# EAGLE design ViticultureShield (EAGLE 8.6.3)

## Sheet 1 of 10: DUE and Power
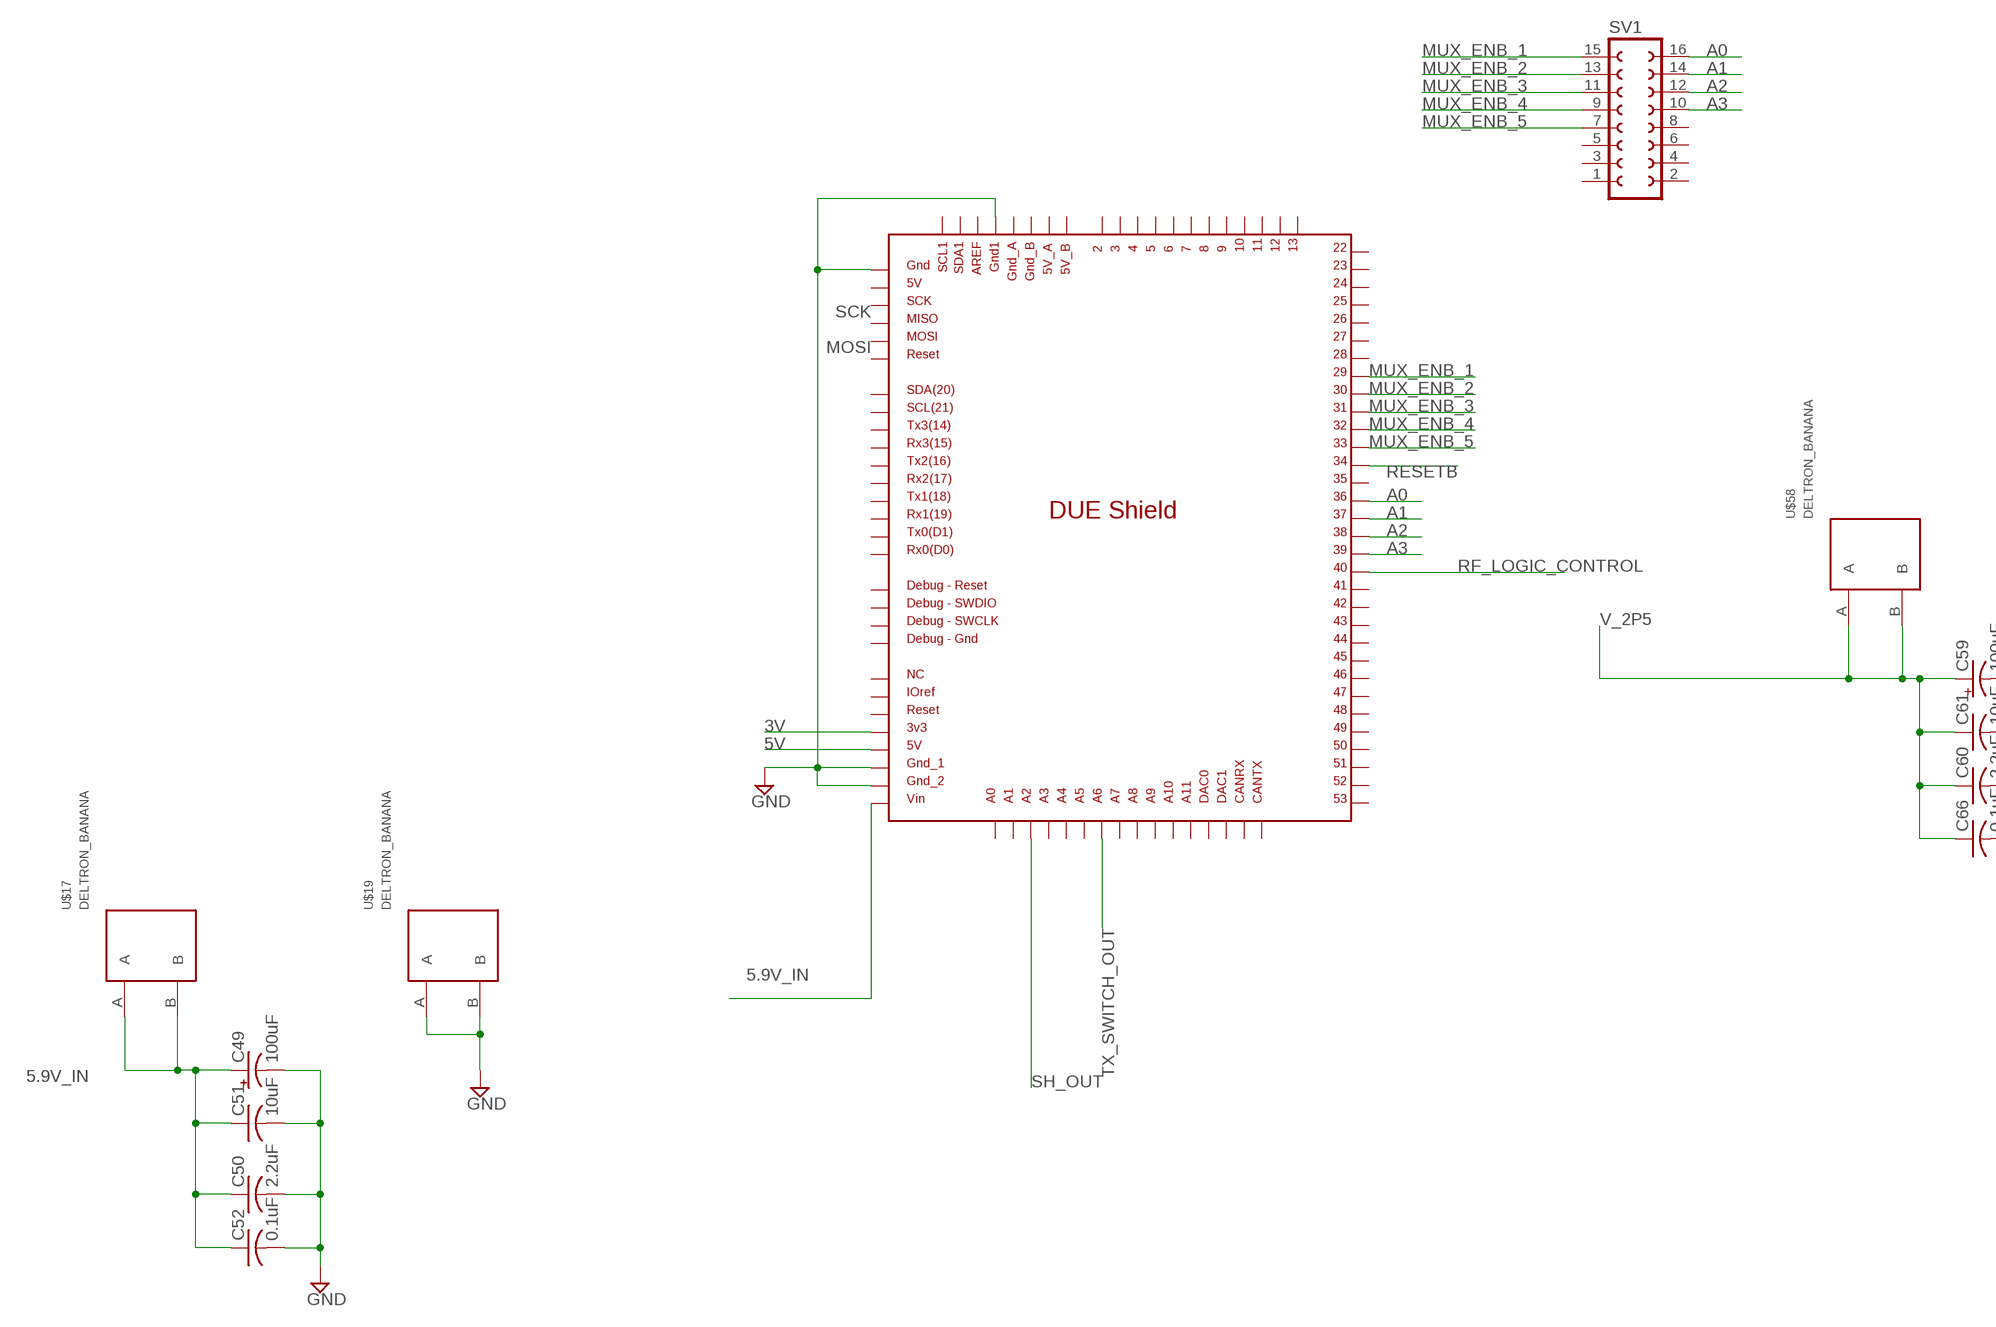
[diagram p0: schematic, sheet 1, part 1 of 2]
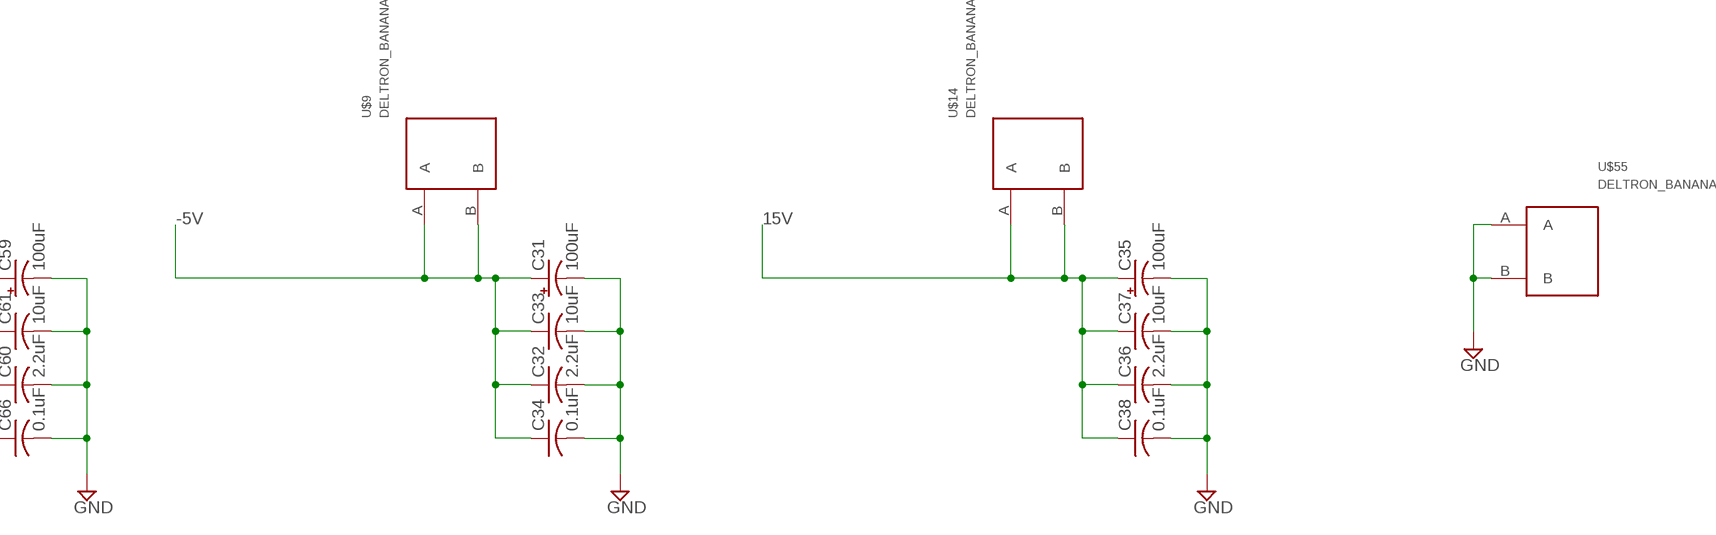
[diagram p1: schematic, sheet 1, part 2 of 2]

### Parts
C31  100uF  CAP_POL_DEV  [CAP_POL_RADIAL_8MM_3P5MMPAD]
C32  2.2uF  C-USC0603  [C0603]
C33  10uF  C-USC1206  [C1206]
C34  0.1uF  C-USC0603  [C0603]
C35  100uF  CAP_POL_DEV  [CAP_POL_RADIAL_8MM_3P5MMPAD]
C36  2.2uF  C-USC0603  [C0603]
C37  10uF  C-USC1206  [C1206]
C38  0.1uF  C-USC0603  [C0603]
C49  100uF  CAP_POL_DEV  [CAP_POL_RADIAL_8MM_3P5MMPAD]
C50  2.2uF  C-USC0603  [C0603]
C51  10uF  C-USC1206  [C1206]
C52  0.1uF  C-USC0603  [C0603]
C59  100uF  CAP_POL_DEV  [CAP_POL_RADIAL_8MM_3P5MMPAD]
C60  2.2uF  C-USC0603  [C0603]
C61  10uF  C-USC1206  [C1206]
C66  0.1uF  C-USC0603  [C0603]
SV1  FE08-2  [FE08-2]
U$1  DUE(NORMAL)  [DUE(NORMAL)]
U$9  DELTRON_BANANA  [DELTRON_BANANA]
U$14  DELTRON_BANANA  [DELTRON_BANANA]
U$17  DELTRON_BANANA  [DELTRON_BANANA]
U$19  DELTRON_BANANA  [DELTRON_BANANA]
U$55  DELTRON_BANANA  [DELTRON_BANANA]
U$58  DELTRON_BANANA  [DELTRON_BANANA]

### Nets
3V: U$1.3V3 ; also sheet 8
5.9V_IN: C49.PIN+ C50.1 C51.1 C52.1 U$1.VIN U$17.A U$17.B
5V: U$1.5V ; also sheet 5,6,8
15V: C35.PIN+ C36.1 C37.1 C38.1 U$14.A U$14.B ; also sheet 6
-5V: C31.PIN+ C32.1 C33.1 C34.1 U$9.A U$9.B ; also sheet 6,7
A0: U$1.36 ; also sheet 2
GND: C31.PIN- C32.2 C33.2 C34.2 C35.PIN- C36.2 C37.2 C38.2 C49.PIN- C50.2 C51.2 C52.2 C59.PIN- C60.2 C61.2 C66.2 U$1.5V_ICSP U$1.GND1 U$1.GND_1 U$1.GND_2 U$19.A U$19.B U$55.A U$55.B ; also sheet 2,3,4,5,6,7,8,9
MUX_ENB_1: SV1.15 U$1.29 ; also sheet 2
MUX_ENB_2: SV1.13 U$1.30 ; also sheet 2
MUX_ENB_3: SV1.11 U$1.31 ; also sheet 2
MUX_ENB_4: SV1.9 U$1.32 ; also sheet 2
MUX_ENB_5: SV1.7 U$1.33 ; also sheet 2
RESETB: U$1.34
RF_LOGIC_CONTROL: U$1.40 ; also sheet 7
SH_OUT: U$1.A2 ; also sheet 6
TX_SWITCH_OUT: U$1.A6
V_2P5: C59.PIN+ C60.1 C61.1 C66.1 U$58.A U$58.B ; also sheet 2
Unconnected: SV1.1 SV1.2 SV1.3 SV1.4 SV1.5 SV1.6 SV1.8 SV1.10 SV1.12 SV1.14 SV1.16 U$1.2 U$1.3 U$1.4 U$1.5 U$1.5V_A U$1.5V_B U$1.6 U$1.7 U$1.8 U$1.9 U$1.10 U$1.11 U$1.12 U$1.13 U$1.22 U$1.23 U$1.24 U$1.25 U$1.26 U$1.27 U$1.28 U$1.35 U$1.37 U$1.38 U$1.39 U$1.41 U$1.42 U$1.43 U$1.44 U$1.45 U$1.46 U$1.47 U$1.48 U$1.49 U$1.50 U$1.51 U$1.52 U$1.53 U$1.A0 U$1.A1 U$1.A3 U$1.A4 U$1.A5 U$1.A7 U$1.A8 U$1.A9 U$1.A10 U$1.A11 U$1.AREF U$1.CANRX U$1.CANTX U$1.DAC0 U$1.DAC1 U$1.GND_A U$1.GND_B U$1.GND_DEBUG U$1.GND_ICSP U$1.IOREF U$1.MISO_ICSP U$1.MOSI_ICSP U$1.NC U$1.RESET U$1.RESET_DEBUG U$1.RESET_ICSP U$1.RX0 U$1.RX1 U$1.RX2 U$1.RX3 U$1.SCK_ICSP U$1.SCL U$1.SCL1 U$1.SDA U$1.SDA1 U$1.SWCLK_DEBUG U$1.SWDIO_DEBUG U$1.TX0 U$1.TX1 U$1.TX2 U$1.TX3

## Sheet 2 of 10: 16:1 Mux's (breakout board)
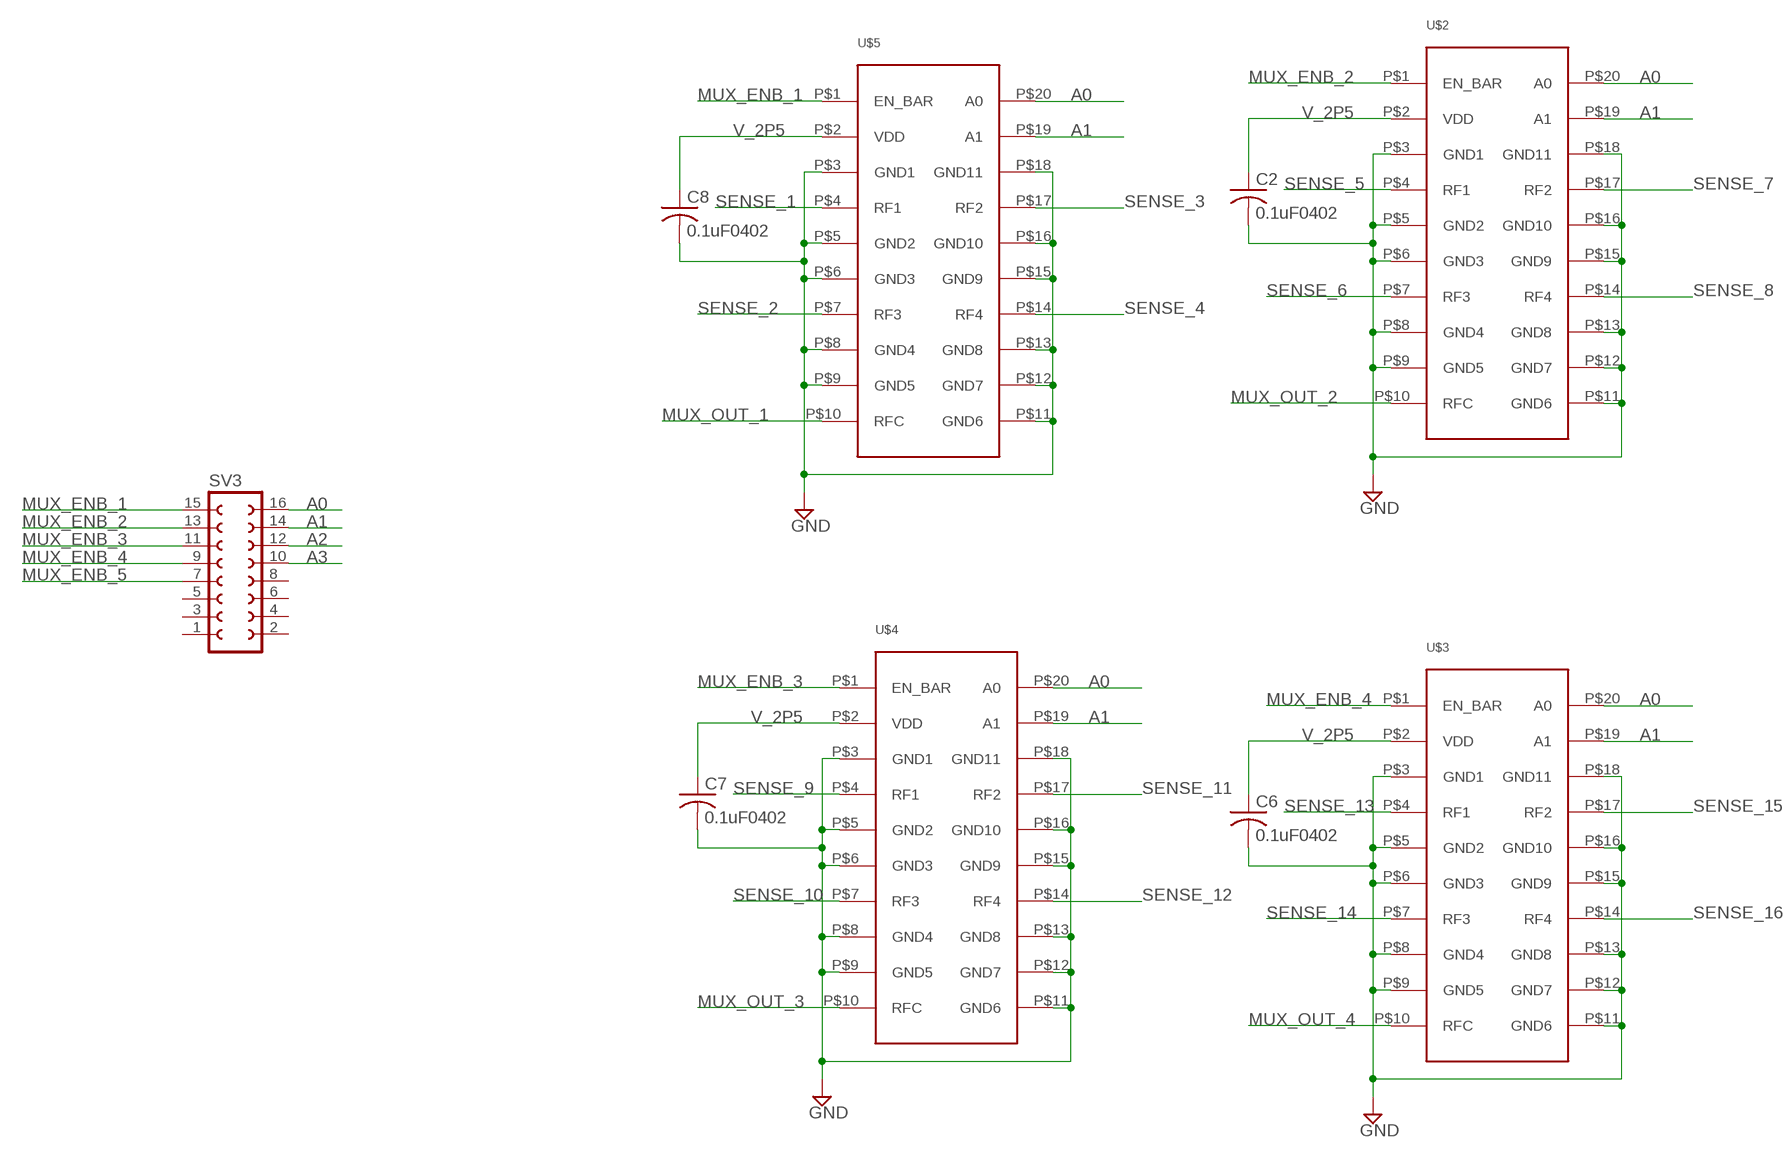
[diagram p2: schematic, sheet 2, part 1 of 2]
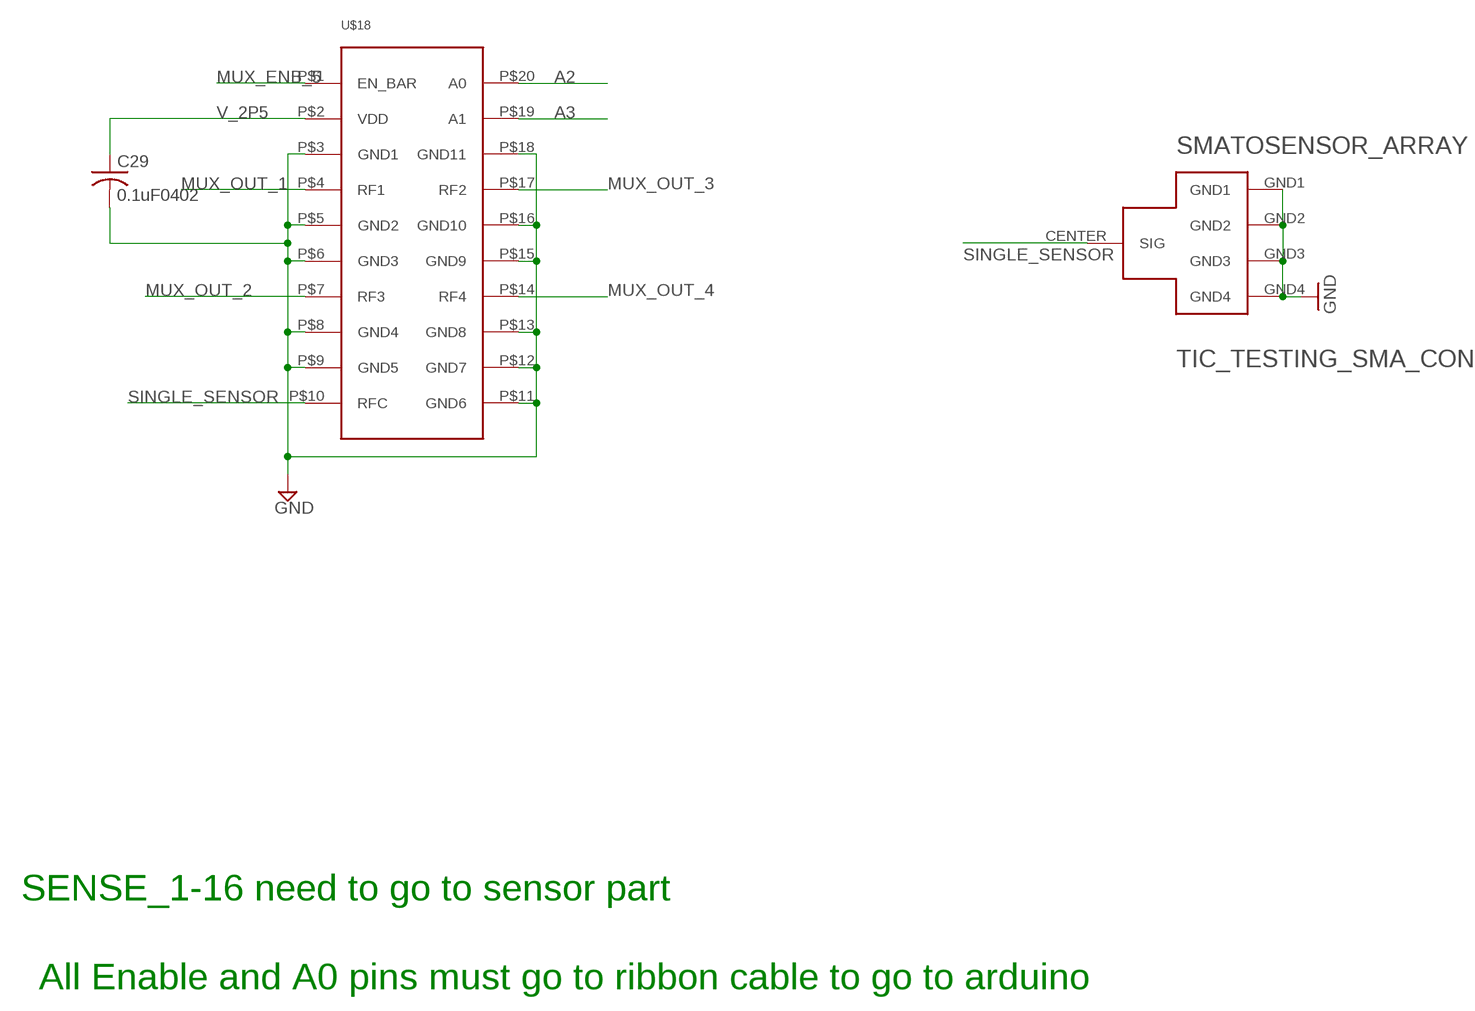
[diagram p3: schematic, sheet 2, part 2 of 2]

### Parts
C2  0.1uF0402  C-USC0402  [C0402]
C6  0.1uF0402  C-USC0402  [C0402]
C7  0.1uF0402  C-USC0402  [C0402]
C8  0.1uF0402  C-USC0402  [C0402]
C29  0.1uF0402  C-USC0402  [C0402]
SMATOSENSOR_ARRAY  TIC_TESTING_SMA_CONN  [TIC_TESTING_SMA_CONNECTOR_V1]
SV3  FE08-2  [FE08-2]
U$2  TICLIB2_ADG904  [TICLIB2_ADG904_TSSOP]
U$3  TICLIB2_ADG904  [TICLIB2_ADG904_TSSOP]
U$4  TICLIB2_ADG904  [TICLIB2_ADG904_TSSOP]
U$5  TICLIB2_ADG904  [TICLIB2_ADG904_TSSOP]
U$18  TICLIB2_ADG904  [TICLIB2_ADG904_TSSOP]

### Nets
A0: SV3.16 U$2.P$20(A0) U$3.P$20(A0) U$4.P$20(A0) U$5.P$20(A0) ; also sheet 1
A1: SV3.14 U$2.P$19(A1) U$3.P$19(A1) U$4.P$19(A1) U$5.P$19(A1) ; also sheet 1
A2: SV3.12 U$18.P$20(A0) ; also sheet 1
A3: SV3.10 U$18.P$19(A1) ; also sheet 1
GND: C2.2 C6.2 C7.2 C8.2 C29.2 SMATOSENSOR_ARRAY.GND1 SMATOSENSOR_ARRAY.GND2 SMATOSENSOR_ARRAY.GND3 SMATOSENSOR_ARRAY.GND4 U$2.P$3(GND1) U$2.P$5(GND2) U$2.P$6(GND3) U$2.P$8(GND4) U$2.P$9(GND5) U$2.P$11(GND6) U$2.P$12(GND7) U$2.P$13(GND8) U$2.P$15(GND9) U$2.P$16(GND10) U$2.P$18(GND11) U$3.P$3(GND1) U$3.P$5(GND2) U$3.P$6(GND3) U$3.P$8(GND4) U$3.P$9(GND5) U$3.P$11(GND6) U$3.P$12(GND7) U$3.P$13(GND8) U$3.P$15(GND9) U$3.P$16(GND10) U$3.P$18(GND11) U$4.P$3(GND1) U$4.P$5(GND2) U$4.P$6(GND3) U$4.P$8(GND4) U$4.P$9(GND5) U$4.P$11(GND6) U$4.P$12(GND7) U$4.P$13(GND8) U$4.P$15(GND9) U$4.P$16(GND10) U$4.P$18(GND11) U$5.P$3(GND1) U$5.P$5(GND2) U$5.P$6(GND3) U$5.P$8(GND4) U$5.P$9(GND5) U$5.P$11(GND6) U$5.P$12(GND7) U$5.P$13(GND8) U$5.P$15(GND9) U$5.P$16(GND10) U$5.P$18(GND11) U$18.P$3(GND1) U$18.P$5(GND2) U$18.P$6(GND3) U$18.P$8(GND4) U$18.P$9(GND5) U$18.P$11(GND6) U$18.P$12(GND7) U$18.P$13(GND8) U$18.P$15(GND9) U$18.P$16(GND10) U$18.P$18(GND11) ; also sheet 1,3,4,5,6,7,8,9
MUX_ENB_1: SV3.15 U$5.P$1(EN_BAR) ; also sheet 1
MUX_ENB_2: SV3.13 U$2.P$1(EN_BAR) ; also sheet 1
MUX_ENB_3: SV3.11 U$4.P$1(EN_BAR) ; also sheet 1
MUX_ENB_4: SV3.9 U$3.P$1(EN_BAR) ; also sheet 1
MUX_ENB_5: SV3.7 U$18.P$1(EN_BAR) ; also sheet 1
MUX_OUT_1: U$5.P$10(RFC) U$18.P$4(RF1)
MUX_OUT_2: U$2.P$10(RFC) U$18.P$7(RF3)
MUX_OUT_3: U$4.P$10(RFC) U$18.P$17(RF2)
MUX_OUT_4: U$3.P$10(RFC) U$18.P$14(RF4)
SENSE_1: U$5.P$4(RF1)
SENSE_2: U$5.P$7(RF3)
SENSE_3: U$5.P$17(RF2)
SENSE_4: U$5.P$14(RF4)
SENSE_5: U$2.P$4(RF1)
SENSE_6: U$2.P$7(RF3)
SENSE_7: U$2.P$17(RF2)
SENSE_8: U$2.P$14(RF4)
SENSE_9: U$4.P$4(RF1)
SENSE_10: U$4.P$7(RF3)
SENSE_11: U$4.P$17(RF2)
SENSE_12: U$4.P$14(RF4)
SENSE_13: U$3.P$4(RF1)
SENSE_14: U$3.P$7(RF3)
SENSE_15: U$3.P$17(RF2)
SENSE_16: U$3.P$14(RF4)
SINGLE_SENSOR: SMATOSENSOR_ARRAY.CENTER(SIG) U$18.P$10(RFC)
V_2P5: C2.1 C6.1 C7.1 C8.1 C29.1 U$2.P$2(VDD) U$3.P$2(VDD) U$4.P$2(VDD) U$5.P$2(VDD) U$18.P$2(VDD) ; also sheet 1
Unconnected: SV3.1 SV3.2 SV3.3 SV3.4 SV3.5 SV3.6 SV3.8

### Notes on the sheet
- SENSE_1-16 need to go to sensor part
- All Enable and A0 pins must go to ribbon cable to go to arduino

## Sheet 3 of 10: Sensor SMA- Onboard
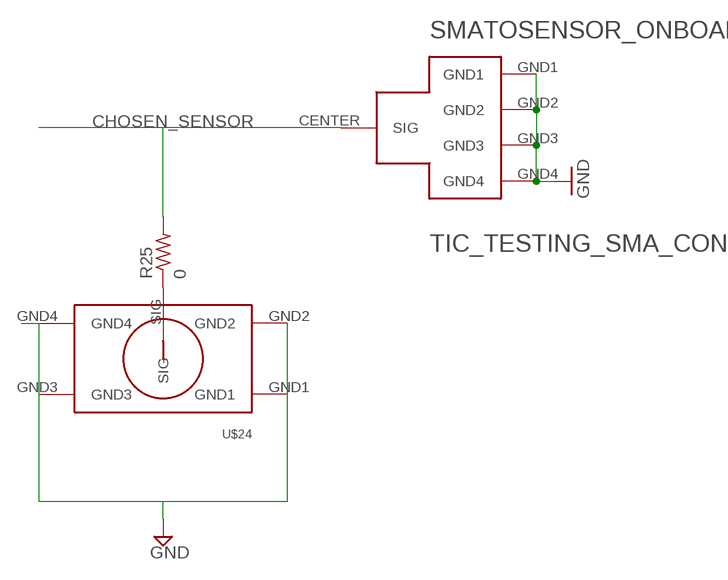
[diagram p4: schematic, sheet 3]

### Parts
R25  0  R-US_R0603  [R0603]
SMATOSENSOR_ONBOARD  TIC_TESTING_SMA_CONN  [TIC_TESTING_SMA_CONNECTOR_V1]
U$24  MINISMP_PE44970_THRUHOLE  [MINISMP_PE44970_THRU_HOLE]

### Nets
CHOSEN_SENSOR: R25.2 SMATOSENSOR_ONBOARD.CENTER(SIG) ; also sheet 4
GND: SMATOSENSOR_ONBOARD.GND1 SMATOSENSOR_ONBOARD.GND2 SMATOSENSOR_ONBOARD.GND3 SMATOSENSOR_ONBOARD.GND4 U$24.GND1 U$24.GND2 U$24.GND3 ; also sheet 1,2,4,5,6,7,8,9
N$39: R25.1 U$24.SIG
Unconnected: U$24.GND4

## Sheet 4 of 10: RF Amplifier
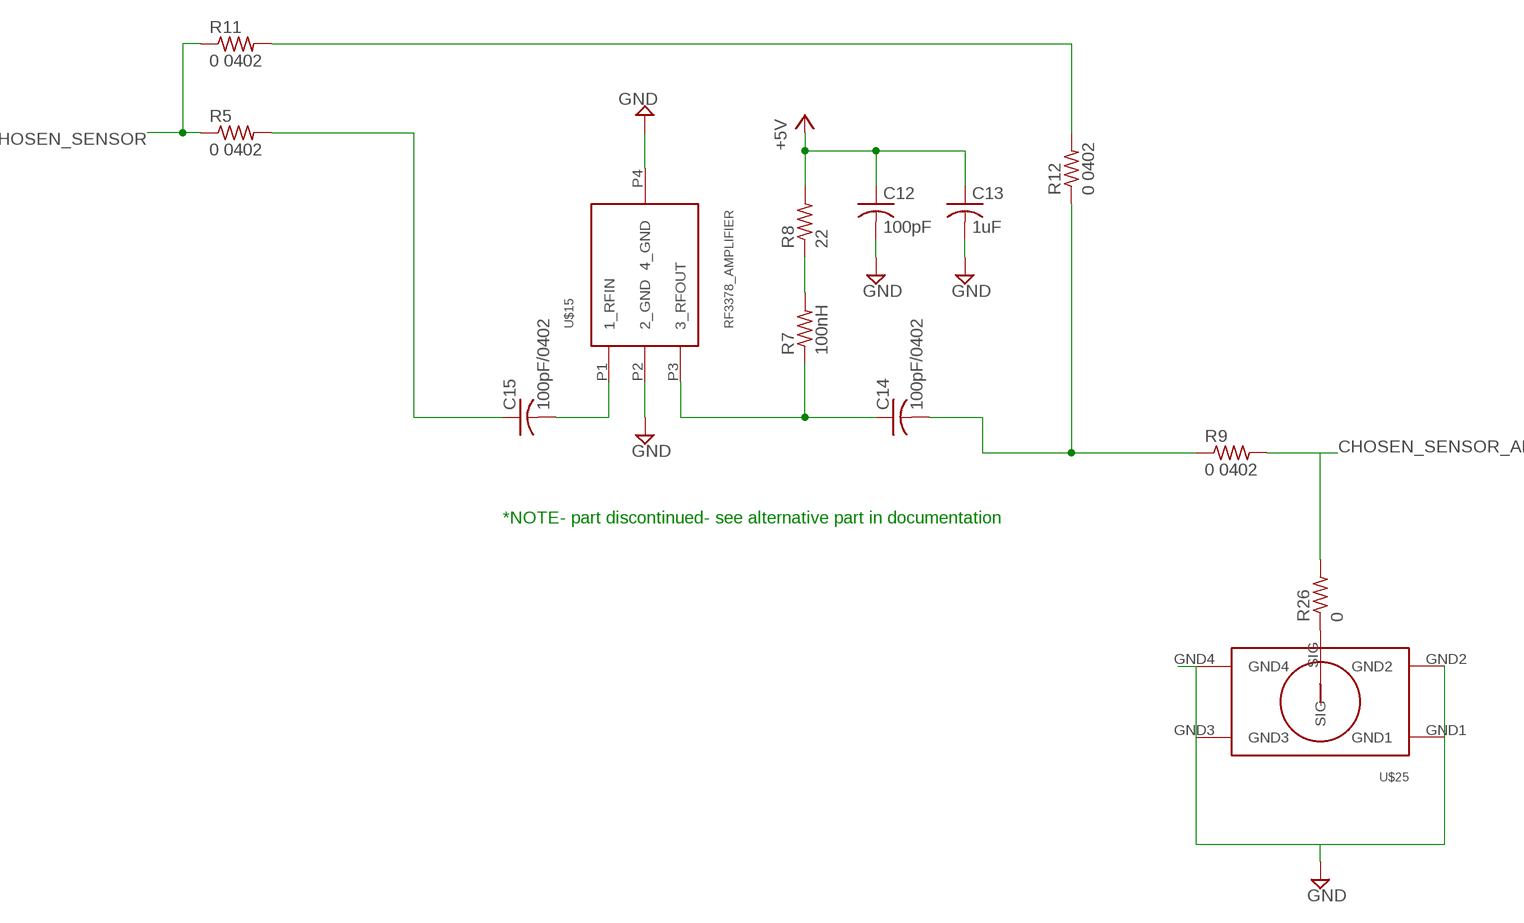
[diagram p5: schematic, sheet 4]

### Parts
C12  100pF  C-USC0603  [C0603]
C13  1uF  C-USC0603  [C0603]
C14  100pF/0402  C-USC0402  [C0402]
C15  100pF/0402  C-USC0402  [C0402]
R5  0 0402  R-US_R0402  [R0402]
R7  100nH  R-US_R0603  [R0603]
R8  22  R-US_R0805  [R0805]
R9  0 0402  R-US_R0402  [R0402]
R11  0 0402  R-US_R0402  [R0402]
R12  0 0402  R-US_R0402  [R0402]
R26  0  R-US_R0603  [R0603]
U$15  RF3378_AMPLIFIER  [TO243AA/SOT89]
U$25  MINISMP_PE44970_THRUHOLE  [MINISMP_PE44970_THRU_HOLE]

### Nets
+5V: C12.1 C13.1 R8.2 ; also sheet 5
CHOSEN_SENSOR: R5.1 R11.1 ; also sheet 3
CHOSEN_SENSOR_AMP: R9.2 R26.2
GND: C12.2 C13.2 U$15.P2(2_GND) U$15.P4(4_GND) U$25.GND1 U$25.GND2 U$25.GND3 ; also sheet 1,2,3,5,6,7,8,9
N$11: C14.1 R7.1 U$15.P3(3_RFOUT)
N$12: R7.2 R8.1
N$13: C15.2 U$15.P1(1_RFIN)
N$14: C14.2 R9.1 R12.1
N$15: C15.1 R5.2
N$32: R11.2 R12.2
N$40: R26.1 U$25.SIG
Unconnected: U$25.GND4

### Notes on the sheet
- *NOTE- part discontinued- see alternative part in documentation

## Sheet 5 of 10: Envelope Detector
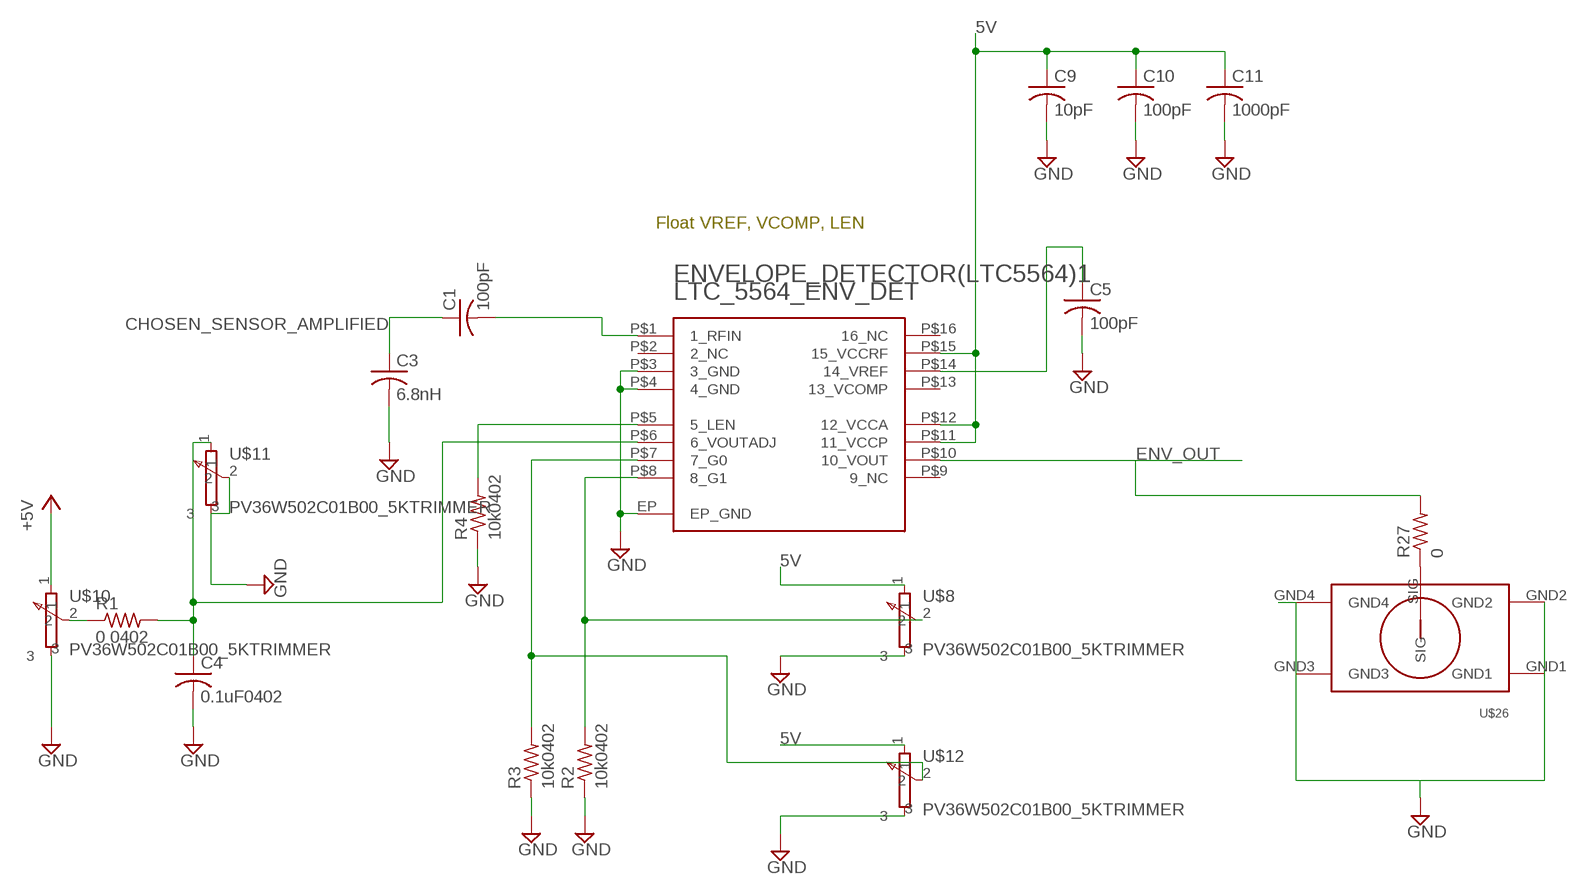
[diagram p6: schematic, sheet 5]

### Parts
C1  100pF  C-USC0402  [C0402]
C3  6.8nH  C-USC0402  [C0402]
C4  0.1uF0402  C-USC0402  [C0402]
C5  100pF  C-USC0402  [C0402]
C9  10pF  C-USC0402  [C0402]
C10  100pF  C-USC0402  [C0402]
C11  1000pF  C-USC0402  [C0402]
ENVELOPE_DETECTOR(LTC5564)1  LTC_5564_ENV_DET  [QFN16]
R1  0 0402  R-US_R0402  [R0402]
R2  10k0402  R-US_R0402  [R0402]
R3  10k0402  R-US_R0402  [R0402]
R4  10k0402  R-US_R0402  [R0402]
R27  0  R-US_R0603  [R0603]
U$8  PV36W502C01B00_5KTRIMMER  [PV36W502C01B00_5KTRIMMER]
U$10  PV36W502C01B00_5KTRIMMER  [PV36W502C01B00_5KTRIMMER]
U$11  PV36W502C01B00_5KTRIMMER  [PV36W502C01B00_5KTRIMMER]
U$12  PV36W502C01B00_5KTRIMMER  [PV36W502C01B00_5KTRIMMER]
U$26  MINISMP_PE44970_THRUHOLE  [MINISMP_PE44970_THRU_HOLE]

### Nets
5V: U$8.1 U$12.1 ; also sheet 1,6,8
+5V: U$10.1 ; also sheet 4
CHOSEN_SENSOR_AMPLIFIED: C1.1 C3.1
ENV_OUT: ENVELOPE_DETECTOR(LTC5564)1.P$10(10_VOUT) R27.2 ; also sheet 6
GND: C3.2 C4.2 C5.2 C9.2 C10.2 C11.2 ENVELOPE_DETECTOR(LTC5564)1.EP(EP_GND) ENVELOPE_DETECTOR(LTC5564)1.P$3(3_GND) ENVELOPE_DETECTOR(LTC5564)1.P$4(4_GND) R2.1 R3.1 R4.1 U$8.3 U$10.3 U$12.3 U$26.GND1 U$26.GND2 U$26.GND3 ; also sheet 1,2,3,4,6,7,8,9
N$1: C1.2 ENVELOPE_DETECTOR(LTC5564)1.P$1(1_RFIN)
N$2: C4.1 ENVELOPE_DETECTOR(LTC5564)1.P$6(6_VOUTADJ) R1.2 U$11.1
N$4: R1.1 U$10.2
N$5: C5.1 ENVELOPE_DETECTOR(LTC5564)1.P$14(14_VREF)
N$6: ENVELOPE_DETECTOR(LTC5564)1.P$8(8_G1) R2.2 U$8.2
N$7: ENVELOPE_DETECTOR(LTC5564)1.P$7(7_G0) R3.2 U$12.2
N$9: ENVELOPE_DETECTOR(LTC5564)1.P$5(5_LEN) R4.2
N$10: U$11.2 U$11.3
N$26: C9.1 C10.1 C11.1 ENVELOPE_DETECTOR(LTC5564)1.P$11(11_VCCP) ENVELOPE_DETECTOR(LTC5564)1.P$12(12_VCCA) ENVELOPE_DETECTOR(LTC5564)1.P$15(15_VCCRF)
N$41: R27.1 U$26.SIG
Unconnected: ENVELOPE_DETECTOR(LTC5564)1.P$2(2_NC) ENVELOPE_DETECTOR(LTC5564)1.P$9(9_NC) ENVELOPE_DETECTOR(LTC5564)1.P$13(13_VCOMP) ENVELOPE_DETECTOR(LTC5564)1.P$16(16_NC) U$26.GND4

### Notes on the sheet
- Float VREF, VCOMP, LEN

## Sheet 6 of 10: Sample and Hold
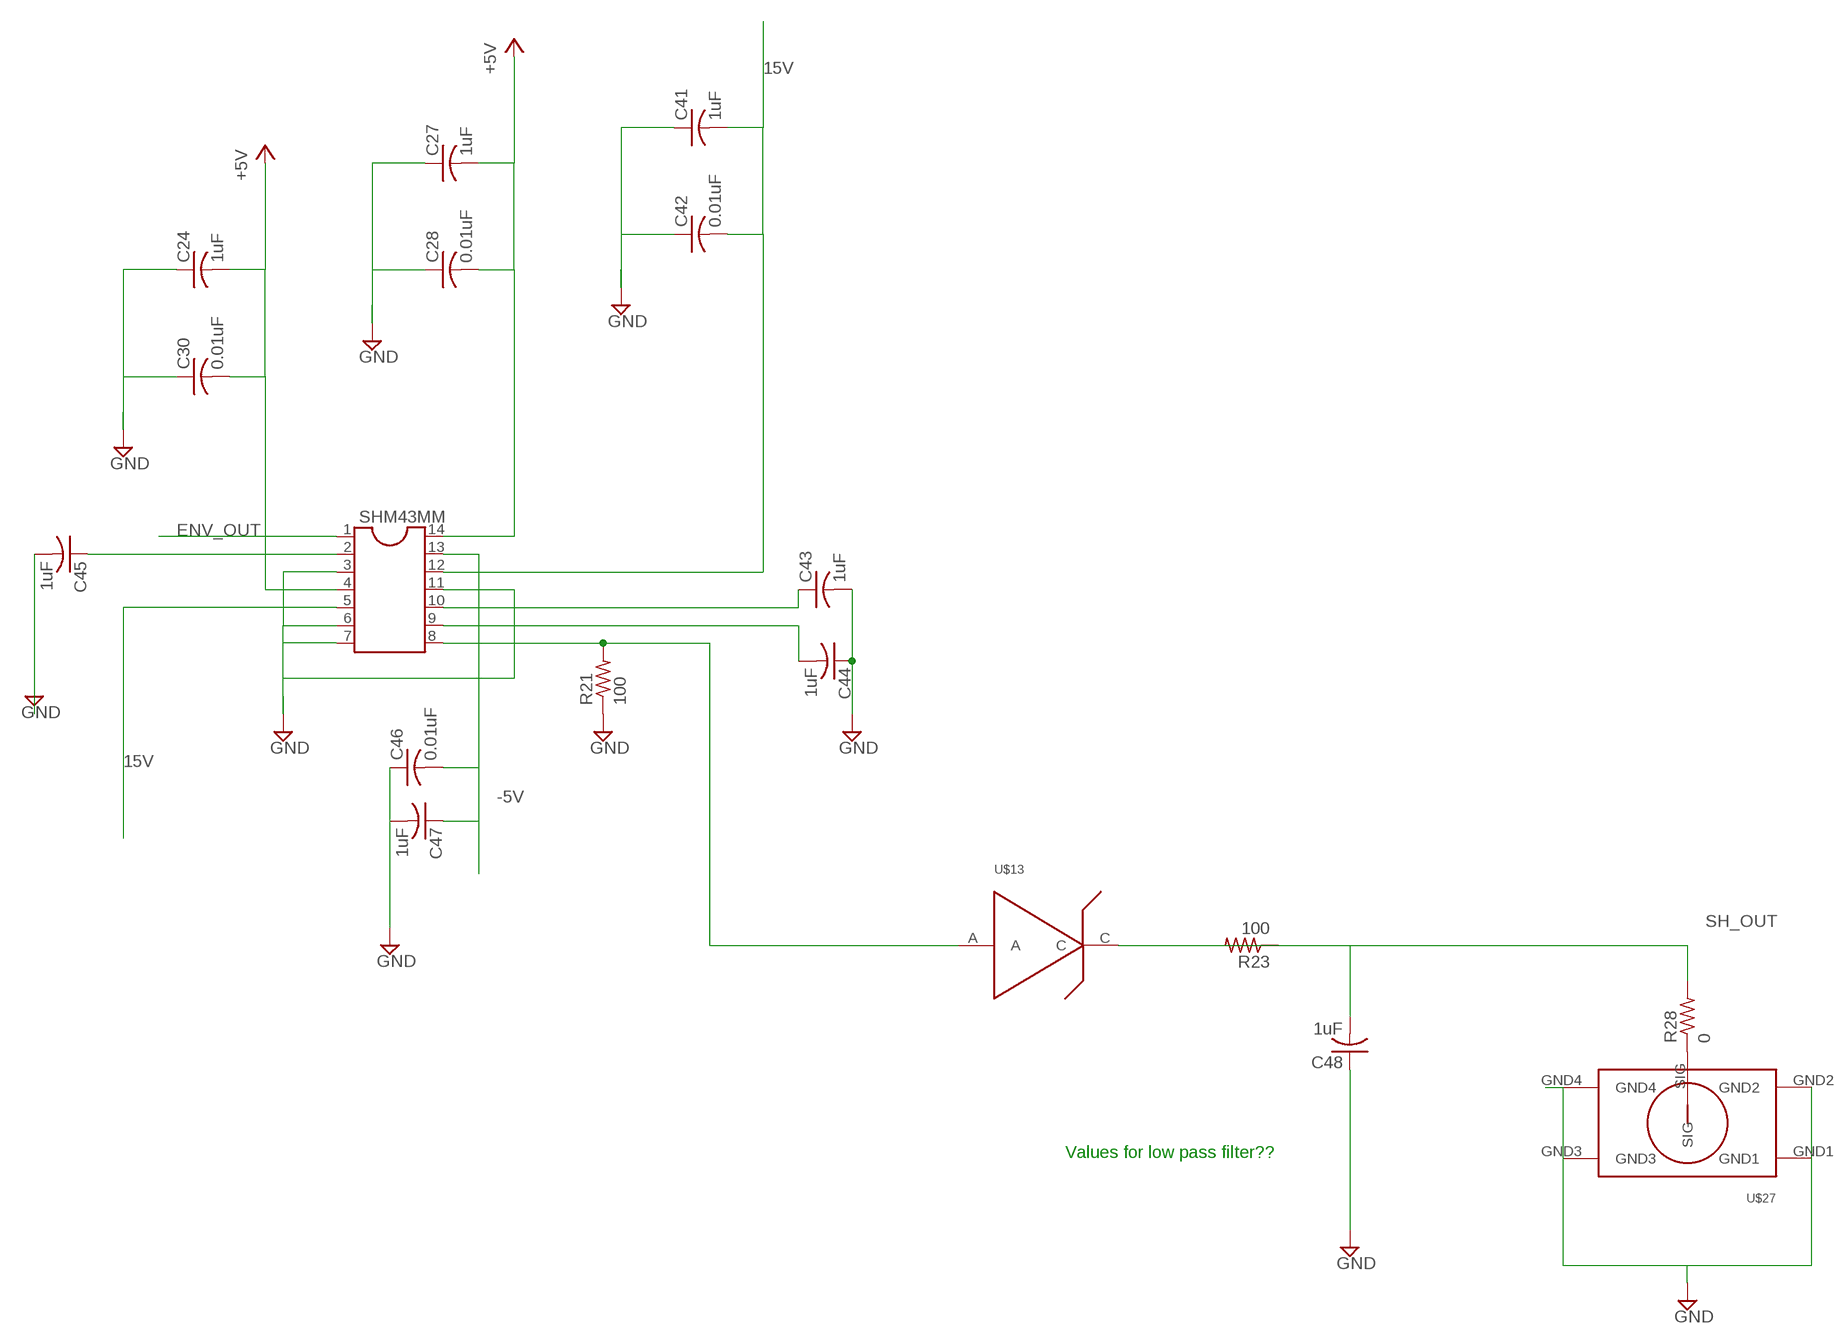
[diagram p7: schematic, sheet 6]

### Parts
C24  1uF  C-USC0402  [C0402]
C27  1uF  C-USC0402  [C0402]
C28  0.01uF  C-USC0402  [C0402]
C30  0.01uF  C-USC0402  [C0402]
C41  1uF  C-USC0402  [C0402]
C42  0.01uF  C-USC0402  [C0402]
C43  1uF  C-USC0402  [C0402]
C44  1uF  C-USC0402  [C0402]
C45  1uF  C-USC0402  [C0402]
C46  0.01uF  C-USC0402  [C0402]
C47  1uF  C-USC0402  [C0402]
C48  1uF  C-USC0402  [C0402]
R21  100  R-US_R0603  [R0603]
R23  100  R-US_R0603  [R0603]
R28  0  R-US_R0603  [R0603]
SHM43MM  DIL14  [DIL14]
U$13  ZENER_MMSZ4689-TP  [SOD123]
U$27  MINISMP_PE44970_THRUHOLE  [MINISMP_PE44970_THRU_HOLE]

### Nets
5V: C24.2 C27.2 C28.2 C30.2 SHM43MM.4 SHM43MM.14 ; supply symbol labelled +5V ; also sheet 1,5,8
15V: C41.2 C42.2 SHM43MM.5 SHM43MM.12 ; also sheet 1
-5V: C46.2 C47.1 SHM43MM.13 ; also sheet 1,7
ENV_OUT: SHM43MM.1 ; also sheet 5
GND: C24.1 C27.1 C28.1 C30.1 C41.1 C42.1 C43.2 C44.1 C45.2 R21.1 SHM43MM.3 SHM43MM.6 SHM43MM.7 SHM43MM.11 U$27.GND1 U$27.GND2 U$27.GND3 ; also sheet 1,2,3,4,5,7,8,9
N$22: C43.1 SHM43MM.10
N$25: C44.2 SHM43MM.9
N$27: C45.1 SHM43MM.2
N$34: C46.1
N$42: R28.1 U$27.SIG
SAH_OUTPUT: R21.2 SHM43MM.8 U$13.A
SH_OUT: C48.2 R28.2 U$13.C ; also sheet 1
Unconnected: C47.2 C48.1 R23.1 R23.2 U$27.GND4

### Notes on the sheet
- Values for low pass filter??

## Sheet 7 of 10: RF Switch
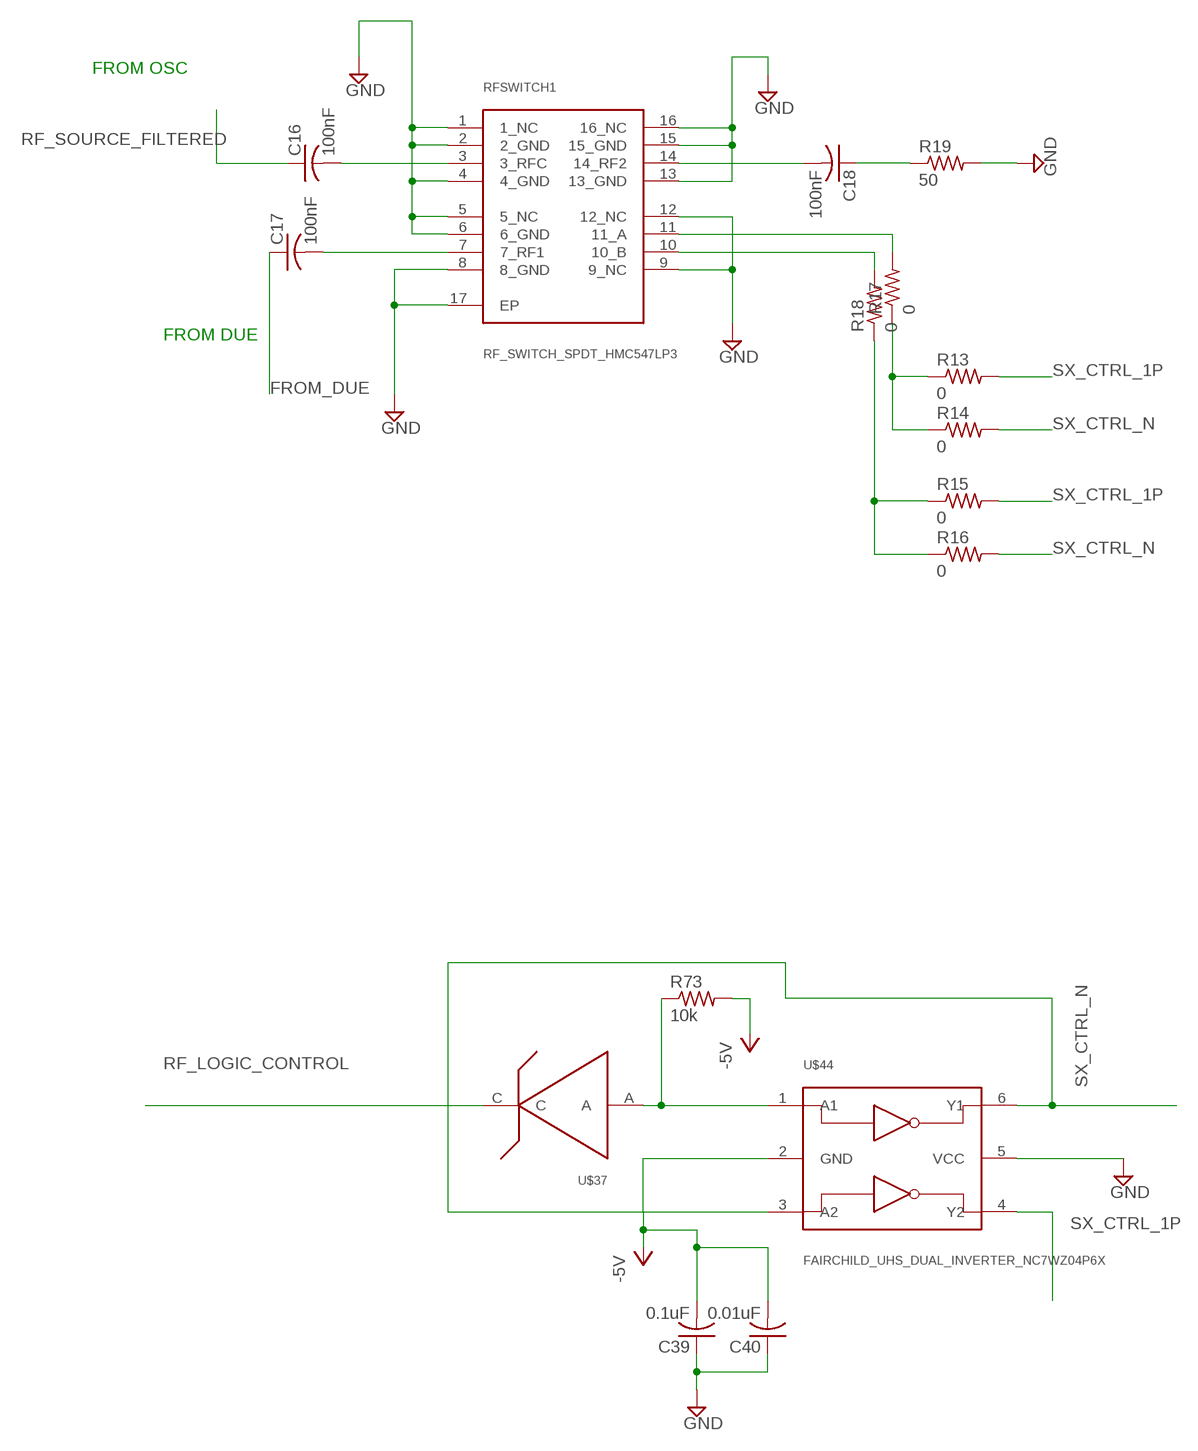
[diagram p8: schematic, sheet 7]

### Parts
C16  100nF  C-USC0603  [C0603]
C17  100nF  C-USC0603  [C0603]
C18  100nF  C-USC0603  [C0603]
C39  0.1uF  C-USC0603  [C0603]
C40  0.01uF  C-USC0603  [C0603]
R13  0  R-US_R0603  [R0603]
R14  0  R-US_R0603  [R0603]
R15  0  R-US_R0603  [R0603]
R16  0  R-US_R0603  [R0603]
R17  0  R-US_R0603  [R0603]
R18  0  R-US_R0603  [R0603]
R19  50  R-US_R0603  [R0603]
R73  10k  R-US_R0603  [R0603]
RFSWITCH1  RF_SWITCH_SPDT_HMC547LP3  [CP_16_3]
U$37  ZENER_MMSZ4689-TP  [SOD123]
U$44  FAIRCHILD_UHS_DUAL_INVERTER_NC7WZ04P6X  [FAIRCHILD_DUAL_INVERTER_NC7WZ04P6X]

### Nets
-5V: C39.2 C40.2 R73.2 U$44.2(GND) ; also sheet 1,6
FROM_DUE: C17.1
GND: C39.1 C40.1 R19.2 RFSWITCH1.1(1_NC) RFSWITCH1.2(2_GND) RFSWITCH1.4(4_GND) RFSWITCH1.5(5_NC) RFSWITCH1.6(6_GND) RFSWITCH1.8(8_GND) RFSWITCH1.9(9_NC) RFSWITCH1.12(12_NC) RFSWITCH1.13(13_GND) RFSWITCH1.15(15_GND) RFSWITCH1.16(16_NC) RFSWITCH1.17(EP) U$44.5(VCC) ; also sheet 1,2,3,4,5,6,8,9
N$3: C16.2 RFSWITCH1.3(3_RFC)
N$8: C17.2 RFSWITCH1.7(7_RF1)
N$23: R73.1 U$37.A U$44.1(A1)
N$24: C18.2 RFSWITCH1.14(14_RF2)
N$28: R17.2 RFSWITCH1.11(11_A)
N$29: R15.1 R16.1 R18.1
N$30: R18.2 RFSWITCH1.10(10_B)
N$31: R13.1 R14.1 R17.1
N$33: C18.1 R19.1
RF_LOGIC_CONTROL: U$37.C ; also sheet 1
RF_SOURCE_FILTERED: C16.1 ; also sheet 9
SX_CTRL_1P: R13.2 R15.2 U$44.4(Y2)
SX_CTRL_N: R14.2 R16.2 U$44.3(A2) U$44.6(Y1)

### Notes on the sheet
- FROM OSC
- FROM DUE

## Sheet 8 of 10: Oscillator
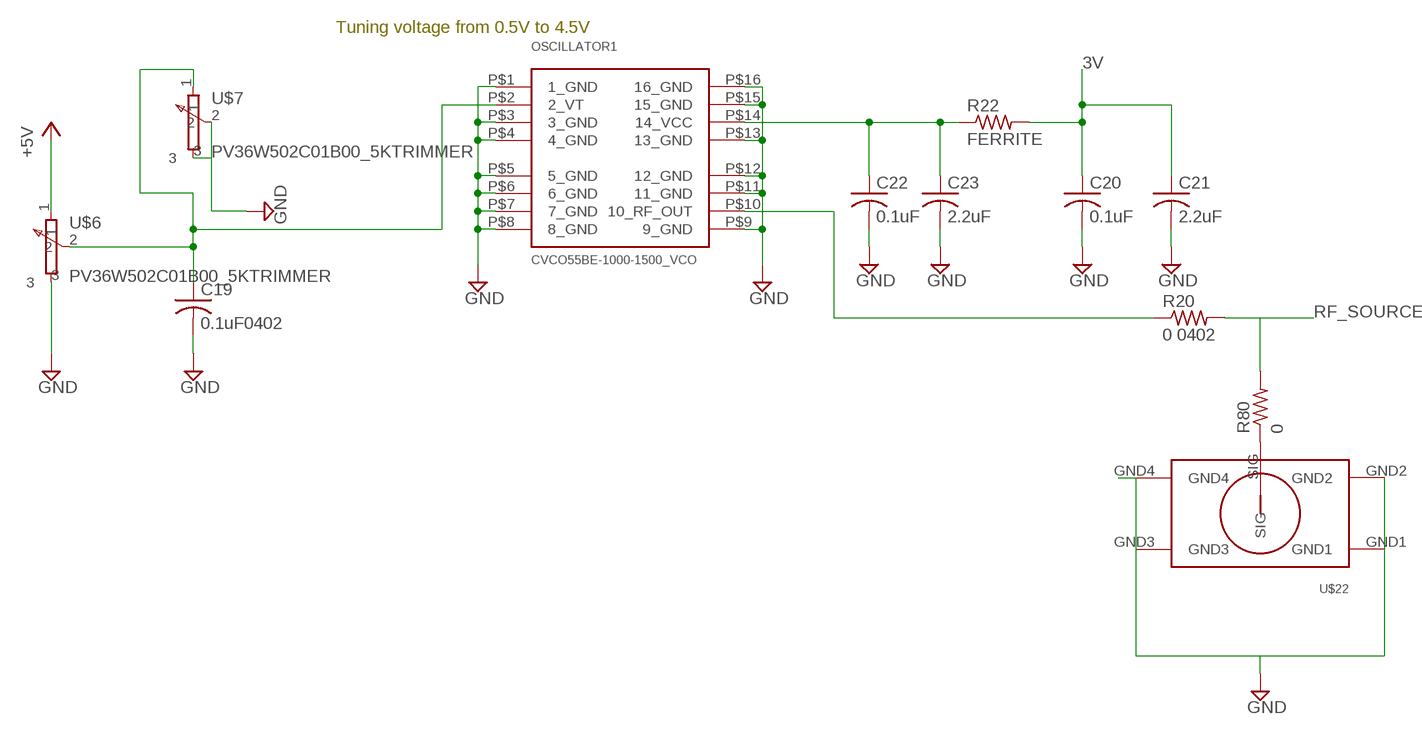
[diagram p9: schematic, sheet 8]

### Parts
C19  0.1uF0402  C-USC0402  [C0402]
C20  0.1uF  C-USC0603  [C0603]
C21  2.2uF  C-USC0603  [C0603]
C22  0.1uF  C-USC0603  [C0603]
C23  2.2uF  C-USC0603  [C0603]
OSCILLATOR1  CVCO55BE-1000-1500_VCO  [CVCO55BE-1000-1500_VCO]
R20  0 0402  R-US_R0402  [R0402]
R22  FERRITE  R-US_R0603  [R0603]
R80  0  R-US_R0603  [R0603]
U$6  PV36W502C01B00_5KTRIMMER  [PV36W502C01B00_5KTRIMMER]
U$7  PV36W502C01B00_5KTRIMMER  [PV36W502C01B00_5KTRIMMER]
U$22  MINISMP_PE44970_THRUHOLE  [MINISMP_PE44970_THRU_HOLE]

### Nets
3V: C20.1 C21.1 R22.2 ; also sheet 1
5V: U$6.1 ; supply symbol labelled +5V ; also sheet 1,5,6
GND: C19.2 C20.2 C21.2 C22.2 C23.2 OSCILLATOR1.P$1(1_GND) OSCILLATOR1.P$3(3_GND) OSCILLATOR1.P$4(4_GND) OSCILLATOR1.P$5(5_GND) OSCILLATOR1.P$6(6_GND) OSCILLATOR1.P$7(7_GND) OSCILLATOR1.P$8(8_GND) OSCILLATOR1.P$9(9_GND) OSCILLATOR1.P$11(11_GND) OSCILLATOR1.P$12(12_GND) OSCILLATOR1.P$13(13_GND) OSCILLATOR1.P$15(15_GND) OSCILLATOR1.P$16(16_GND) U$6.3 U$7.2 U$7.3 U$22.GND1 U$22.GND2 U$22.GND3 ; also sheet 1,2,3,4,5,6,7,9
N$16: C19.1 OSCILLATOR1.P$2(2_VT) U$6.2 U$7.1
N$17: OSCILLATOR1.P$10(10_RF_OUT) R20.1
N$20: C22.1 C23.1 OSCILLATOR1.P$14(14_VCC) R22.1
N$35: R80.1 U$22.SIG
RF_SOURCE: R20.2 R80.2 ; also sheet 9
Unconnected: U$22.GND4

### Notes on the sheet
- Tuning voltage from 0.5V to 4.5V

## Sheet 9 of 10: Band Pass Filter (Between Oscillator and RF switch)
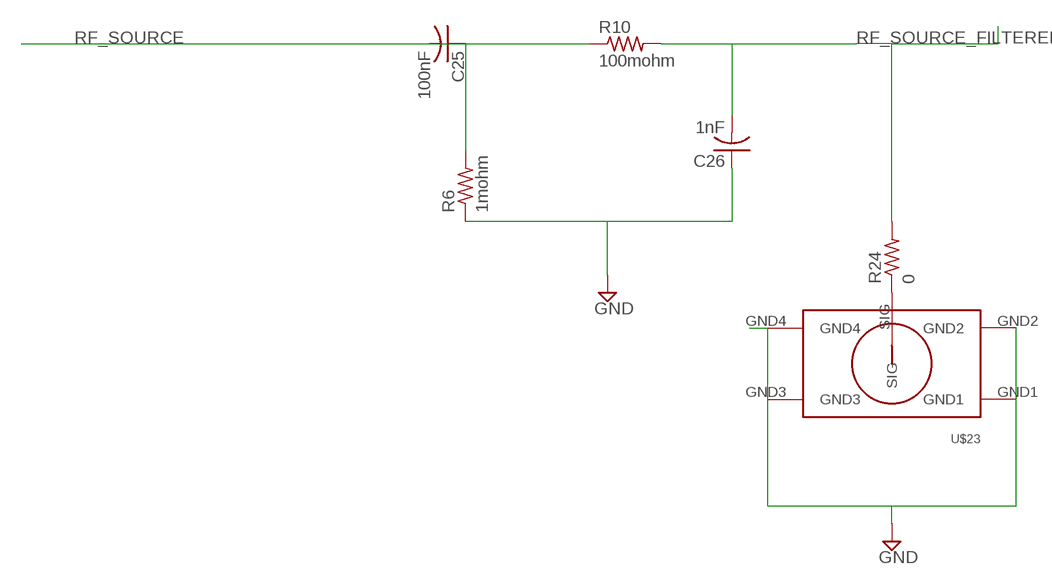
[diagram p10: schematic, sheet 9]

### Parts
C25  100nF  C-USC0603  [C0603]
C26  1nF  C-USC0603  [C0603]
R6  1mohm  R-US_R1206  [R1206]
R10  100mohm  R-US_R1206  [R1206]
R24  0  R-US_R0603  [R0603]
U$23  MINISMP_PE44970_THRUHOLE  [MINISMP_PE44970_THRU_HOLE]

### Nets
GND: C26.1 R6.1 U$23.GND1 U$23.GND2 U$23.GND3 ; also sheet 1,2,3,4,5,6,7,8
N$38: R24.1 U$23.SIG
RF_SOURCE: C25.1 R6.2 R10.1 ; also sheet 8
RF_SOURCE_FILTERED: C26.2 R10.2 R24.2 ; also sheet 7
Unconnected: C25.2 U$23.GND4

## Sheet 10 of 10
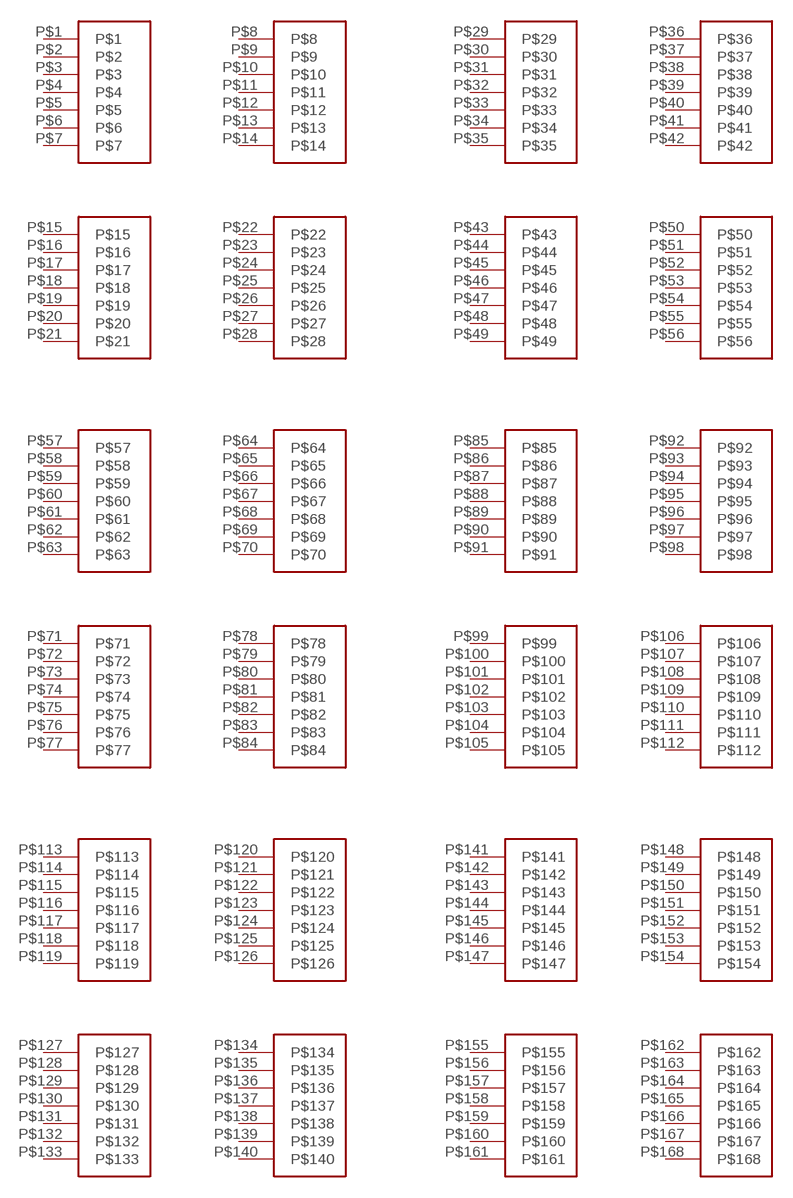
[diagram p11: schematic, sheet 10]

### Parts
U$16  ZRAY_TEST_1  [ZRAY_TEST_1]
Unconnected: U$16.P$1 U$16.P$2 U$16.P$3 U$16.P$4 U$16.P$5 U$16.P$6 U$16.P$7 U$16.P$8 U$16.P$9 U$16.P$10 U$16.P$11 U$16.P$12 U$16.P$13 U$16.P$14 U$16.P$15 U$16.P$16 U$16.P$17 U$16.P$18 U$16.P$19 U$16.P$20 U$16.P$21 U$16.P$22 U$16.P$23 U$16.P$24 U$16.P$25 U$16.P$26 U$16.P$27 U$16.P$28 U$16.P$29 U$16.P$30 U$16.P$31 U$16.P$32 U$16.P$33 U$16.P$34 U$16.P$35 U$16.P$36 U$16.P$37 U$16.P$38 U$16.P$39 U$16.P$40 U$16.P$41 U$16.P$42 U$16.P$43 U$16.P$44 U$16.P$45 U$16.P$46 U$16.P$47 U$16.P$48 U$16.P$49 U$16.P$50 U$16.P$51 U$16.P$52 U$16.P$53 U$16.P$54 U$16.P$55 U$16.P$56 U$16.P$57 U$16.P$58 U$16.P$59 U$16.P$60 U$16.P$61 U$16.P$62 U$16.P$63 U$16.P$64 U$16.P$65 U$16.P$66 U$16.P$67 U$16.P$68 U$16.P$69 U$16.P$70 U$16.P$71 U$16.P$72 U$16.P$73 U$16.P$74 U$16.P$75 U$16.P$76 U$16.P$77 U$16.P$78 U$16.P$79 U$16.P$80 U$16.P$81 U$16.P$82 U$16.P$83 U$16.P$84 U$16.P$85 U$16.P$86 U$16.P$87 U$16.P$88 U$16.P$89 U$16.P$90 U$16.P$91 U$16.P$92 U$16.P$93 U$16.P$94 U$16.P$95 U$16.P$96 U$16.P$97 U$16.P$98 U$16.P$99 U$16.P$100 U$16.P$101 U$16.P$102 U$16.P$103 U$16.P$104 U$16.P$105 U$16.P$106 U$16.P$107 U$16.P$108 U$16.P$109 U$16.P$110 U$16.P$111 U$16.P$112 U$16.P$113 U$16.P$114 U$16.P$115 U$16.P$116 U$16.P$117 U$16.P$118 U$16.P$119 U$16.P$120 U$16.P$121 U$16.P$122 U$16.P$123 U$16.P$124 U$16.P$125 U$16.P$126 U$16.P$127 U$16.P$128 U$16.P$129 U$16.P$130 U$16.P$131 U$16.P$132 U$16.P$133 U$16.P$134 U$16.P$135 U$16.P$136 U$16.P$137 U$16.P$138 U$16.P$139 U$16.P$140 U$16.P$141 U$16.P$142 U$16.P$143 U$16.P$144 U$16.P$145 U$16.P$146 U$16.P$147 U$16.P$148 U$16.P$149 U$16.P$150 U$16.P$151 U$16.P$152 U$16.P$153 U$16.P$154 U$16.P$155 U$16.P$156 U$16.P$157 U$16.P$158 U$16.P$159 U$16.P$160 U$16.P$161 U$16.P$162 U$16.P$163 U$16.P$164 U$16.P$165 U$16.P$166 U$16.P$167 U$16.P$168

## Library data of the parts
C1-C23 C25 C26 C29 C32-C34 C36-C40 C50-C52 C60 C61 C66 = rcl:C-US: CAPACITOR, American symbol
C24 C27 C28 C30 C41-C48 = rcl:C-US: CAPACITOR, American symbol; SPICEPREFIX: C
C31 C35 C49 C59 = RF_servo_SA032212:CAP_POL_DEV: Polarized Capacitor Created on : 03.24.2012 Created by: Serhan Ardanuc
ENVELOPE_DETECTOR(LTC5564)1 = ticLib4:LTC_5564_ENV_DET
OSCILLATOR1 = ticLib4:CVCO55BE-1000-1500_VCO
R1-R5 R7-R9 R11-R28 R73 R80 = rcl:R-US_: RESISTOR, American symbol
R6 R10 = resistor:R-US_: RESISTOR, American symbol
RFSWITCH1 = ticLib2:RF_SWITCH_SPDT_HMC547LP3
SHM43MM = ic-package:DIL14: Dual In Line / Socket
SMATOSENSOR_ARRAY SMATOSENSOR_ONBOARD = FP_BOARD_V3 (1):TIC_TESTING_SMA_CONN
SV1 SV3 = con-lsta:FE08-2: FEMALE HEADER; OC_FARNELL: unknown; OC_NEWARK: unknown
U$1 = DUElib130425:DUE(NORMAL)
U$2 U$18 = FP_BOARD_V3 (1):TICLIB2_ADG904; SPICEPREFIX: X
U$3-U$5 = FP_BOARD_V3 (1):TICLIB2_ADG904
U$6-U$8 U$10-U$12 = blood_viscosity_lib_1:PV36W502C01B00_5KTRIMMER
U$9 U$14 U$17 U$19 U$55 U$58 = tic_lib_3:DELTRON_BANANA
U$13 U$37 = ticLib2:ZENER_MMSZ4689-TP
U$15 = ticLib4:RF3378_AMPLIFIER
U$16 = zray_test_1:ZRAY_TEST_1
U$22-U$27 = ticLib4:MINISMP_PE44970_THRUHOLE
U$44 = tic_testing:FAIRCHILD_UHS_DUAL_INVERTER_NC7WZ04P6X

## Board
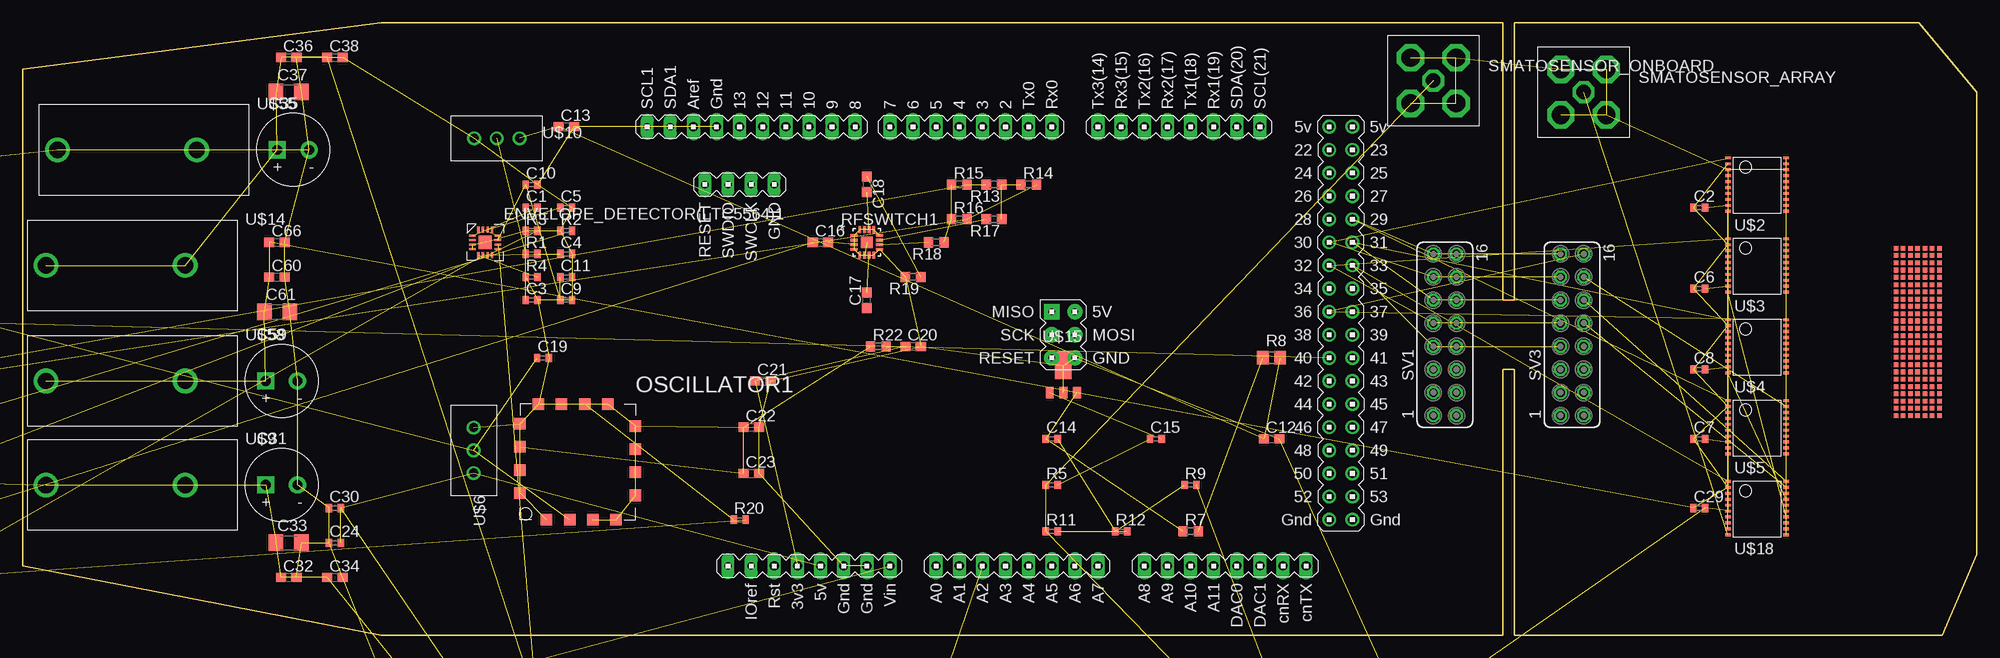
[diagram p12: board, top side]
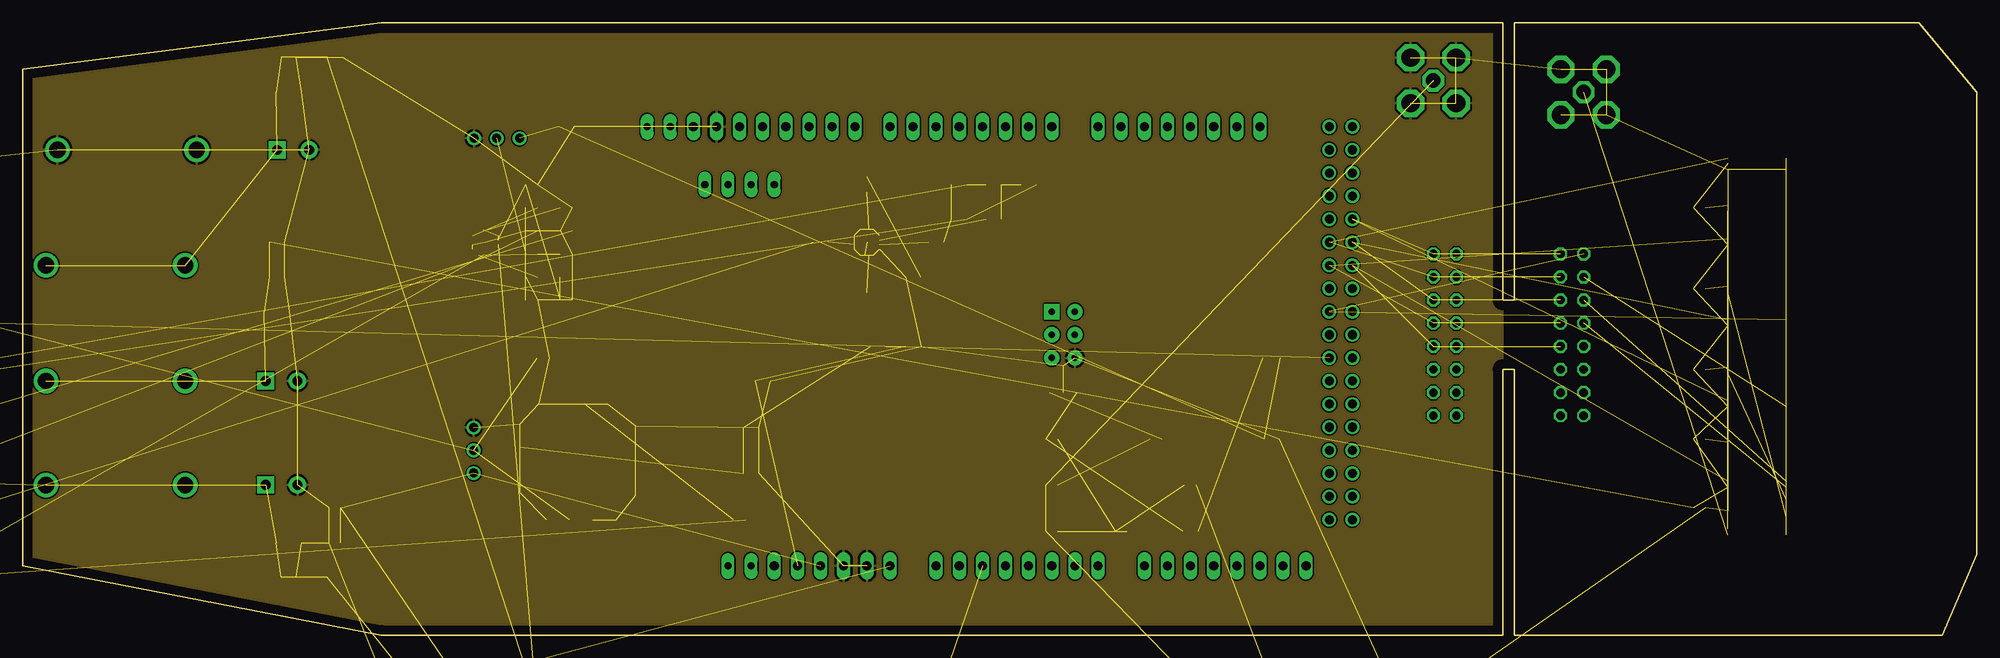
[diagram p13: board, inner layer Route2]

Size 214.63 x 67.31 mm. Coordinates in mm from the lower left corner, seen from the top.
Outline: 39.37,67.31 162.56,67.31 162.56,36.83 163.83,36.83 163.83,67.31 208.28,67.31 214.63,59.69 214.63,8.89 210.82,0 163.83,0 163.83,29.21 162.56,29.21 162.56,0 39.37,0 0,7.62 0,62.23 39.37,67.31
Copper layers (1*2+15*16): Top 0.035mm / dielectric 1.5mm / Route2 0.035mm / dielectric 0.15mm / Route15 0.035mm / dielectric 0.2mm / Bottom 0.035mm
Design rules "default *": minimum track width 6mil, minimum drill 0.35mm, track to track 6mil, track to pad 6mil, pad to pad 6mil, via to via 6mil, smd to smd 6mil, copper to edge 40mil, drill to drill 6mil, minimum pad ring 10mil, minimum via ring 8mil, stop-mask expansion 4mil, vias tented up to drill 0mil, thermal gap 10mil

### Footprints (pad centres in the part's own frame; a part is rotated, then mirrored left to right if it is on the bottom)
C0402 = smd 0.7 x 0.9: 1 -0.65,0; 2 0.65,0
C0603 = smd 1.1 x 1: 1 -0.85,0; 2 0.85,0
CAP_POL_RADIAL_8MM_3P5MMPAD = drill 1.087 pad 1.88 square: PIN+ 0,0 | drill 1.087 pad 1.88: PIN- 3.5,0
C1206 = smd 1.6 x 1.8: 1 -1.4,0; 2 1.4,0
QFN16 = smd 1.45 x 1.45: EP 0,0 | smd 0.7 x 0.25: P$1 -1.4,0.75; P$2 -1.4,0.25; P$3 -1.4,-0.25; P$4 -1.4,-0.75; P$9 1.4,-0.75; P$10 1.4,-0.25; P$11 1.4,0.25; P$12 1.4,0.75 | smd 0.25 x 0.7: P$5 -0.75,-1.4; P$6 -0.25,-1.4; P$7 0.25,-1.4; P$8 0.75,-1.4; P$13 0.75,1.4; P$14 0.25,1.4; P$15 -0.25,1.4; P$16 -0.75,1.4
CVCO55BE-1000-1500_VCO = smd 1.27 x 1.27: P$1 2.921,0; P$2 5.461,0; P$3 8.001,0; P$4 10.541,0; P$5 12.7,2.667; P$6 12.7,5.207; P$7 12.7,7.747; P$8 12.7,10.287; P$9 9.652,12.7; P$10 7.112,12.7; P$11 4.572,12.7; P$12 2.032,12.7; P$13 0,10.541; P$14 0,8.001; P$15 0,5.461; P$16 0,2.921
R0402 = smd 0.7 x 0.9: 1 -0.65,0; 2 0.65,0
R1206 = smd 1.6 x 1.803: 1 -1.422,0; 2 1.422,0
R0603 = smd 1 x 1.1: 1 -0.85,0; 2 0.85,0
R0805 = smd 1.3 x 1.5: 1 -0.95,0; 2 0.95,0
CP_16_3 = smd 0.762 x 0.254: 1 -1.397,0.762; 4 -1.397,-0.762; 9 1.397,-0.762; 12 1.397,0.762 | smd 0.813 x 0.305: 2 -1.397,0.254; 3 -1.397,-0.254; 10 1.397,-0.254; 11 1.397,0.254 | smd 0.254 x 0.762: 5 -0.762,-1.397; 8 0.762,-1.397; 13 0.762,1.397; 16 -0.762,1.397 | smd 0.305 x 0.813: 6 -0.254,-1.397; 7 0.254,-1.397; 14 0.254,1.397; 15 -0.254,1.397 | smd 1.27 x 1.27: 17 0,0
DIL14 = drill 0.813 long: 1 -7.62,-3.81; 2 -5.08,-3.81; 3 -2.54,-3.81; 4 0,-3.81; 5 2.54,-3.81; 6 5.08,-3.81; 7 7.62,-3.81; 8 7.62,3.81; 9 5.08,3.81; 10 2.54,3.81; 11 0,3.81; 12 -2.54,3.81; 13 -5.08,3.81; 14 -7.62,3.81
TIC_TESTING_SMA_CONNECTOR_V1 = drill 1.6 octagon: CENTER 0,0 | drill 2 octagon: GND1 -2.5,2.5; GND2 2.5,2.5; GND3 2.5,-2.5; GND4 -2.5,-2.5
FE08-2 = drill 0.914 octagon: 1 -8.89,1.27; 2 -8.89,-1.27; 3 -6.35,1.27; 4 -6.35,-1.27; 5 -3.81,1.27; 6 -3.81,-1.27; 7 -1.27,1.27; 8 -1.27,-1.27; 9 1.27,1.27; 10 1.27,-1.27; 11 3.81,1.27; 12 3.81,-1.27; 13 6.35,1.27; 14 6.35,-1.27; 15 8.89,1.27; 16 8.89,-1.27
DUE(NORMAL) = drill 1 long: 2 -16.51,30.48; 3 -19.05,30.48; 3V3 -39.37,-17.78; 4 -21.59,30.48; 5 -24.13,30.48; 5V -36.83,-17.78; 6 -26.67,30.48; 7 -29.21,30.48; 8 -33.02,30.48; 9 -35.56,30.48; 10 -38.1,30.48; 11 -40.64,30.48; 12 -43.18,30.48; 13 -45.72,30.48; A0 -24.13,-17.78; A1 -21.59,-17.78; A2 -19.05,-17.78; A3 -16.51,-17.78; A4 -13.97,-17.78; A5 -11.43,-17.78; A6 -8.89,-17.78; A7 -6.35,-17.78; A8 -1.27,-17.78; A9 1.27,-17.78; A10 3.81,-17.78; A11 6.35,-17.78; AREF -50.8,30.48; AREF1 -50.8,30.48; CANRX 13.97,-17.78; CANTX 16.51,-17.78; DAC0 8.89,-17.78; DAC1 11.43,-17.78; GND1 -48.26,30.48; GND_1 -34.29,-17.78; GND_2 -31.75,-17.78; RESET -41.91,-17.78; RX0 -11.43,30.48; RX1 6.35,30.48; RX2 1.27,30.48; RX3 -3.81,30.48; SCL 11.43,30.48; SDA 8.89,30.48; TX0 -13.97,30.48; TX1 3.81,30.48; TX2 -1.27,30.48; TX3 -6.35,30.48; VIN -29.21,-17.78 | drill 1: 5V_A 19.05,30.48; 5V_B 21.59,30.48; 22 19.05,27.94; 23 21.59,27.94; 24 19.05,25.4; 25 21.59,25.4; 26 19.05,22.86; 27 21.59,22.86; 28 19.05,20.32; 29 21.59,20.32; 30 19.05,17.78; 31 21.59,17.78; 32 19.05,15.24; 33 21.59,15.24; 34 19.05,12.7; 35 21.59,12.7; 36 19.05,10.16; 37 21.59,10.16; 38 19.05,7.62; 39 21.59,7.62; 40 19.05,5.08; 41 21.59,5.08; 42 19.05,2.54; 43 21.59,2.54; 44 19.05,0; 45 21.59,0; 46 19.05,-2.54; 47 21.59,-2.54; 48 19.05,-5.08; 49 21.59,-5.08; 50 19.05,-7.62; 51 21.59,-7.62; 52 19.05,-10.16; 53 21.59,-10.16; GND_A 19.05,-12.7; GND_B 21.59,-12.7 | drill 0.7 pad 1.676: 5V_ICSP -8.89,5.08; GND_ICSP -8.89,10.16; MOSI_ICSP -8.89,7.62; RESET_ICSP -11.43,5.08; SCK_ICSP -11.43,7.62 | drill 0.8 pad 1.422 long: GND_DEBUG -41.91,24.13; IOREF -44.45,-17.78; NC -46.99,-17.78; RESET_DEBUG -49.53,24.13; SCL1 -55.88,30.48; SDA1 -53.34,30.48; SWCLK_DEBUG -44.45,24.13; SWDIO_DEBUG -46.99,24.13 | drill 0.7 pad 1.676 square: MISO_ICSP -11.43,10.16
TICLIB2_ADG904_TSSOP = smd 0.61 x 0.305: P$1 -3.2,2.925; P$2 -3.2,2.275; P$3 -3.2,1.625; P$4 -3.2,0.975; P$5 -3.2,0.325; P$6 -3.2,-0.325; P$7 -3.2,-0.975; P$8 -3.2,-1.625; P$9 -3.2,-2.275; P$10 -3.2,-2.925; P$11 3.2,-2.925; P$12 3.2,-2.275; P$13 3.2,-1.625; P$14 3.2,-0.975; P$15 3.2,-0.325; P$16 3.2,0.325; P$17 3.2,0.975; P$18 3.2,1.625; P$19 3.2,2.275; P$20 3.2,2.925
PV36W502C01B00_5KTRIMMER = drill 1: 1 2.5,0; 2 0,0; 3 -2.5,0
DELTRON_BANANA = drill 1.8: A 0,0; B 15.3,0
SOD123 = smd 0.914 x 1.219: A 0,0; C 3.277,0
TO243AA/SOT89 = smd 0.86 x 1.27: P1 -1.5,0; P2 0,0; P3 1.5,0 | smd 1.8 x 3: P4 0,3
ZRAY_TEST_1 = smd 0.5 x 0.5: P$1 0,0; P$2 0,-0.8; P$3 0,-1.6; P$4 0,-2.4; P$5 0,-3.2; P$6 0,-4; P$7 0,-4.8; P$8 0.8,0; P$9 0.8,-0.8; P$10 0.8,-1.6; P$11 0.8,-2.4; P$12 0.8,-3.2; P$13 0.8,-4; P$14 0.8,-4.8; P$15 1.6,0; P$16 1.6,-0.8; P$17 1.6,-1.6; P$18 1.6,-2.4; P$19 1.6,-3.2; P$20 1.6,-4; P$21 1.6,-4.8; P$22 2.4,0; P$23 2.4,-0.8; P$24 2.4,-1.6; P$25 2.4,-2.4; P$26 2.4,-3.2; P$27 2.4,-4; P$28 2.4,-4.8; P$29 3.2,0; P$30 3.2,-0.8; P$31 3.2,-1.6; P$32 3.2,-2.4; P$33 3.2,-3.2; P$34 3.2,-4; P$35 3.2,-4.8; P$36 4,0; P$37 4,-0.8; P$38 4,-1.6; P$39 4,-2.4; P$40 4,-3.2; P$41 4,-4; P$42 4,-4.8; P$43 4.8,0; P$44 4.8,-0.8; P$45 4.8,-1.6; P$46 4.8,-2.4; P$47 4.8,-3.2; P$48 4.8,-4; P$49 4.8,-4.8; P$50 5.6,0; P$51 5.6,-0.8; P$52 5.6,-1.6; P$53 5.6,-2.4; P$54 5.6,-3.2; P$55 5.6,-4; P$56 5.6,-4.8; P$57 6.4,0; P$58 6.4,-0.8; P$59 6.4,-1.6; P$60 6.4,-2.4; P$61 6.4,-3.2; P$62 6.4,-4; P$63 6.4,-4.8; P$64 7.2,0; P$65 7.2,-0.8; P$66 7.2,-1.6; P$67 7.2,-2.4; P$68 7.2,-3.2; P$69 7.2,-4; P$70 7.2,-4.8; P$71 8,0; P$72 8,-0.8; P$73 8,-1.6; P$74 8,-2.4; P$75 8,-3.2; P$76 8,-4; P$77 8,-4.8; P$78 8.8,0; P$79 8.8,-0.8; P$80 8.8,-1.6; P$81 8.8,-2.4; P$82 8.8,-3.2; P$83 8.8,-4; P$84 8.8,-4.8; P$85 9.6,0; P$86 9.6,-0.8; P$87 9.6,-1.6; P$88 9.6,-2.4; P$89 9.6,-3.2; P$90 9.6,-4; P$91 9.6,-4.8; P$92 10.4,0; P$93 10.4,-0.8; P$94 10.4,-1.6; P$95 10.4,-2.4; P$96 10.4,-3.2; P$97 10.4,-4; P$98 10.4,-4.8; P$99 11.2,0; P$100 11.2,-0.8; P$101 11.2,-1.6; P$102 11.2,-2.4; P$103 11.2,-3.2; P$104 11.2,-4; P$105 11.2,-4.8; P$106 12,0; P$107 12,-0.8; P$108 12,-1.6; P$109 12,-2.4; P$110 12,-3.2; P$111 12,-4; P$112 12,-4.8; P$113 12.8,0; P$114 12.8,-0.8; P$115 12.8,-1.6; P$116 12.8,-2.4; P$117 12.8,-3.2; P$118 12.8,-4; P$119 12.8,-4.8; P$120 13.6,0; P$121 13.6,-0.8; P$122 13.6,-1.6; P$123 13.6,-2.4; P$124 13.6,-3.2; P$125 13.6,-4; P$126 13.6,-4.8; P$127 14.4,0; P$128 14.4,-0.8; P$129 14.4,-1.6; P$130 14.4,-2.4; P$131 14.4,-3.2; P$132 14.4,-4; P$133 14.4,-4.8; P$134 15.2,0; P$135 15.2,-0.8; P$136 15.2,-1.6; P$137 15.2,-2.4; P$138 15.2,-3.2; P$139 15.2,-4; P$140 15.2,-4.8; P$141 16,0; P$142 16,-0.8; P$143 16,-1.6; P$144 16,-2.4; P$145 16,-3.2; P$146 16,-4; P$147 16,-4.8; P$148 16.8,0; P$149 16.8,-0.8; P$150 16.8,-1.6; P$151 16.8,-2.4; P$152 16.8,-3.2; P$153 16.8,-4; P$154 16.8,-4.8; P$155 17.6,0; P$156 17.6,-0.8; P$157 17.6,-1.6; P$158 17.6,-2.4; P$159 17.6,-3.2; P$160 17.6,-4; P$161 17.6,-4.8; P$162 18.4,0; P$163 18.4,-0.8; P$164 18.4,-1.6; P$165 18.4,-2.4; P$166 18.4,-3.2; P$167 18.4,-4; P$168 18.4,-4.8
MINISMP_PE44970_THRU_HOLE = drill 0.711: GND1 -1.079,1.079; GND2 1.079,1.079; GND3 1.079,-1.079; GND4 -1.079,-1.079; SIG 0,0
FAIRCHILD_DUAL_INVERTER_NC7WZ04P6X = smd 0.4 x 0.5: 1 -0.65,-0.95; 2 0,-0.95; 3 0.65,-0.95; 4 0.65,0.95; 5 0,0.95; 6 -0.65,0.95

### Placement (x,y rotation side)
C1  55.88,46.99 0 top
C2  184.15,46.99 0 top
C3  55.88,36.83 0 top
C4  59.69,41.91 0 top
C5  59.69,46.99 0 top
C6  184.15,38.1 0 top
C7  184.15,21.59 0 top
C8  184.15,29.21 0 top
C9  59.69,36.83 0 top
C10  55.88,49.53 0 top
C11  59.69,39.37 0 top
C12  137.16,21.59 0 top
C13  59.69,55.88 0 top
C14  113.03,21.59 0 top
C15  124.46,21.59 0 top
C16  87.63,43.18 0 top
C17  92.71,36.83 90 top
C18  92.71,49.53 270 top
C19  57.15,30.48 0 top
C20  97.79,31.75 0 top
C21  81.28,27.94 0 top
C22  80.01,22.86 0 top
C23  80.01,17.78 0 top
C24  34.29,10.16 0 top
C25  -63.5,-10.16 0 top  (outside the outline)
C26  -63.5,-15.24 0 top  (outside the outline)
C27  53.34,-39.37 180 top  (outside the outline)
C28  53.34,-36.83 180 top  (outside the outline)
C29  184.15,13.97 0 top
C30  34.29,13.97 0 top
C31  26.67,16.51 0 top
C32  29.21,6.35 0 top
C33  29.21,10.16 0 top
C34  34.29,6.35 0 top
C35  27.94,53.34 0 top
C36  29.21,63.5 0 top
C37  29.21,59.69 0 top
C38  34.29,63.5 0 top
C39  -54.61,13.97 0 top  (outside the outline)
C40  -63.5,13.97 0 top  (outside the outline)
C41  53.34,-44.45 180 top  (outside the outline)
C42  53.34,-41.91 180 top  (outside the outline)
C43  69.85,-41.91 0 top  (outside the outline)
C44  50.8,-34.29 180 top  (outside the outline)
C45  54.61,-34.29 180 top  (outside the outline)
C46  50.8,-53.34 0 top  (outside the outline)
C47  54.61,-53.34 0 top  (outside the outline)
C48  90.17,-45.72 0 top  (outside the outline)
C49  -52.07,-73.66 0 top  (outside the outline)
C50  -34.29,-72.39 0 top  (outside the outline)
C51  -40.64,-73.66 0 top  (outside the outline)
C52  -26.67,-72.39 0 top  (outside the outline)
C59  26.67,27.94 0 top
C60  27.94,39.37 0 top
C61  27.94,35.56 0 top
C66  27.94,43.18 0 top
ENVELOPE_DETECTOR(LTC5564)1  50.8,43.18 0 top
OSCILLATOR1  54.61,12.7 0 top
R1  55.88,41.91 0 top
R2  59.69,44.45 0 top
R3  55.88,44.45 0 top
R4  55.88,39.37 0 top
R5  113.03,16.51 0 top
R6  -63.5,2.54 0 top  (outside the outline)
R7  128.27,11.43 0 top
R8  137.16,30.48 0 top
R9  128.27,16.51 0 top
R10  -63.5,-3.81 0 top  (outside the outline)
R11  113.03,11.43 0 top
R12  120.65,11.43 0 top
R13  106.68,49.53 180 top
R14  110.49,49.53 0 top
R15  102.87,49.53 0 top
R16  102.87,45.72 0 top
R17  106.68,45.72 180 top
R18  100.33,43.18 180 top
R19  97.79,39.37 180 top
R20  78.74,12.7 0 top
R21  78.74,-45.72 0 top  (outside the outline)
R22  93.98,31.75 0 top
R23  68.58,-54.61 0 top  (outside the outline)
R24  147.32,-17.78 0 top  (outside the outline)
R25  147.32,-25.4 0 top  (outside the outline)
R26  147.32,-34.29 0 top  (outside the outline)
R27  147.32,-41.91 0 top  (outside the outline)
R28  147.32,-49.53 0 top  (outside the outline)
R73  -64.77,8.89 0 top  (outside the outline)
R80  147.32,-10.16 0 top  (outside the outline)
RFSWITCH1  92.71,43.18 0 top
SHM43MM  62.23,-39.37 270 top  (outside the outline)
SMATOSENSOR_ARRAY  171.45,59.69 0 top
SMATOSENSOR_ONBOARD  154.94,60.96 0 top
SV1  156.21,33.02 90 top
SV3  170.18,33.02 90 top
U$1  124.46,25.4 0 top
U$2  190.5,49.53 0 top
U$3  190.5,40.64 0 top
U$4  190.5,31.75 0 top
U$5  190.5,22.86 0 top
U$6  49.53,20.32 270 top
U$7  -55.88,46.99 0 top  (outside the outline)
U$8  -40.64,13.97 0 top  (outside the outline)
U$9  2.54,16.51 0 top
U$10  52.07,54.61 0 top
U$11  -40.64,-8.89 0 top  (outside the outline)
U$12  -40.64,6.35 0 top  (outside the outline)
U$13  83.82,-45.72 0 top  (outside the outline)
U$14  2.54,40.64 0 top
U$15  114.3,26.67 0 top
U$16  205.74,24.13 90 top
U$17  -53.34,-27.94 0 top  (outside the outline)
U$18  190.5,13.97 0 top
U$19  -53.34,-55.88 0 top  (outside the outline)
U$22  152.4,-8.89 0 top  (outside the outline)
U$23  152.4,-17.78 0 top  (outside the outline)
U$24  152.4,-25.4 0 top  (outside the outline)
U$25  152.4,-34.29 0 top  (outside the outline)
U$26  152.4,-41.91 0 top  (outside the outline)
U$27  152.4,-49.53 0 top  (outside the outline)
U$37  -57.15,35.56 0 top  (outside the outline)
U$44  -62.23,19.05 0 top  (outside the outline)
U$55  3.81,53.34 0 top
U$58  2.54,27.94 0 top

### Tracks (layer width: path | path; a pad name or v marks a point on that pad's centre or on a via)
3V  (3 unrouted)
5.9V_IN  (6 unrouted)
5V  (9 unrouted)
15V  (9 unrouted)
+5V  (3 unrouted)
-5V  (12 unrouted)
A0  (5 unrouted)
A1  (4 unrouted)
A2  (1 unrouted)
A3  (1 unrouted)
CHOSEN_SENSOR  (3 unrouted)
CHOSEN_SENSOR_AMP  (1 unrouted)
CHOSEN_SENSOR_AMPLIFIED  (1 unrouted)
ENV_OUT  (2 unrouted)
GND  (181 unrouted)
  pour Route2: 0,62.23 39.37,67.31 162.56,67.31 162.56,0 39.37,0 0,7.62
MUX_ENB_1  (3 unrouted)
MUX_ENB_2  (3 unrouted)
MUX_ENB_3  (3 unrouted)
MUX_ENB_4  (3 unrouted)
MUX_ENB_5  (3 unrouted)
MUX_OUT_1  (1 unrouted)
MUX_OUT_2  (1 unrouted)
MUX_OUT_3  (1 unrouted)
MUX_OUT_4  (1 unrouted)
N$1  (1 unrouted)
N$2  (3 unrouted)
N$3  (1 unrouted)
N$4  (1 unrouted)
N$5  (1 unrouted)
N$6  (2 unrouted)
N$7  (2 unrouted)
N$8  (1 unrouted)
N$9  (1 unrouted)
N$10  (1 unrouted)
N$11  (2 unrouted)
N$12  (1 unrouted)
N$13  (1 unrouted)
N$14  (2 unrouted)
N$15  (1 unrouted)
N$16  (3 unrouted)
N$17  (1 unrouted)
N$20  (3 unrouted)
N$22  (1 unrouted)
N$23  (2 unrouted)
N$24  (1 unrouted)
N$25  (1 unrouted)
N$26  (5 unrouted)
N$27  (1 unrouted)
N$28  (1 unrouted)
N$29  (2 unrouted)
N$30  (1 unrouted)
N$31  (2 unrouted)
N$32  (1 unrouted)
N$33  (1 unrouted)
N$35  (1 unrouted)
N$38  (1 unrouted)
N$39  (1 unrouted)
N$40  (1 unrouted)
N$41  (1 unrouted)
N$42  (1 unrouted)
RF_LOGIC_CONTROL  (1 unrouted)
RF_SOURCE  (4 unrouted)
RF_SOURCE_FILTERED  (3 unrouted)
SAH_OUTPUT  (2 unrouted)
SH_OUT  (3 unrouted)
SINGLE_SENSOR  (1 unrouted)
SX_CTRL_1P  (2 unrouted)
SX_CTRL_N  (3 unrouted)
V_2P5  (15 unrouted)